# EAGLE schematic main_8to1plexer_dma_changed (EAGLE 7.6.0), part 1 of 2
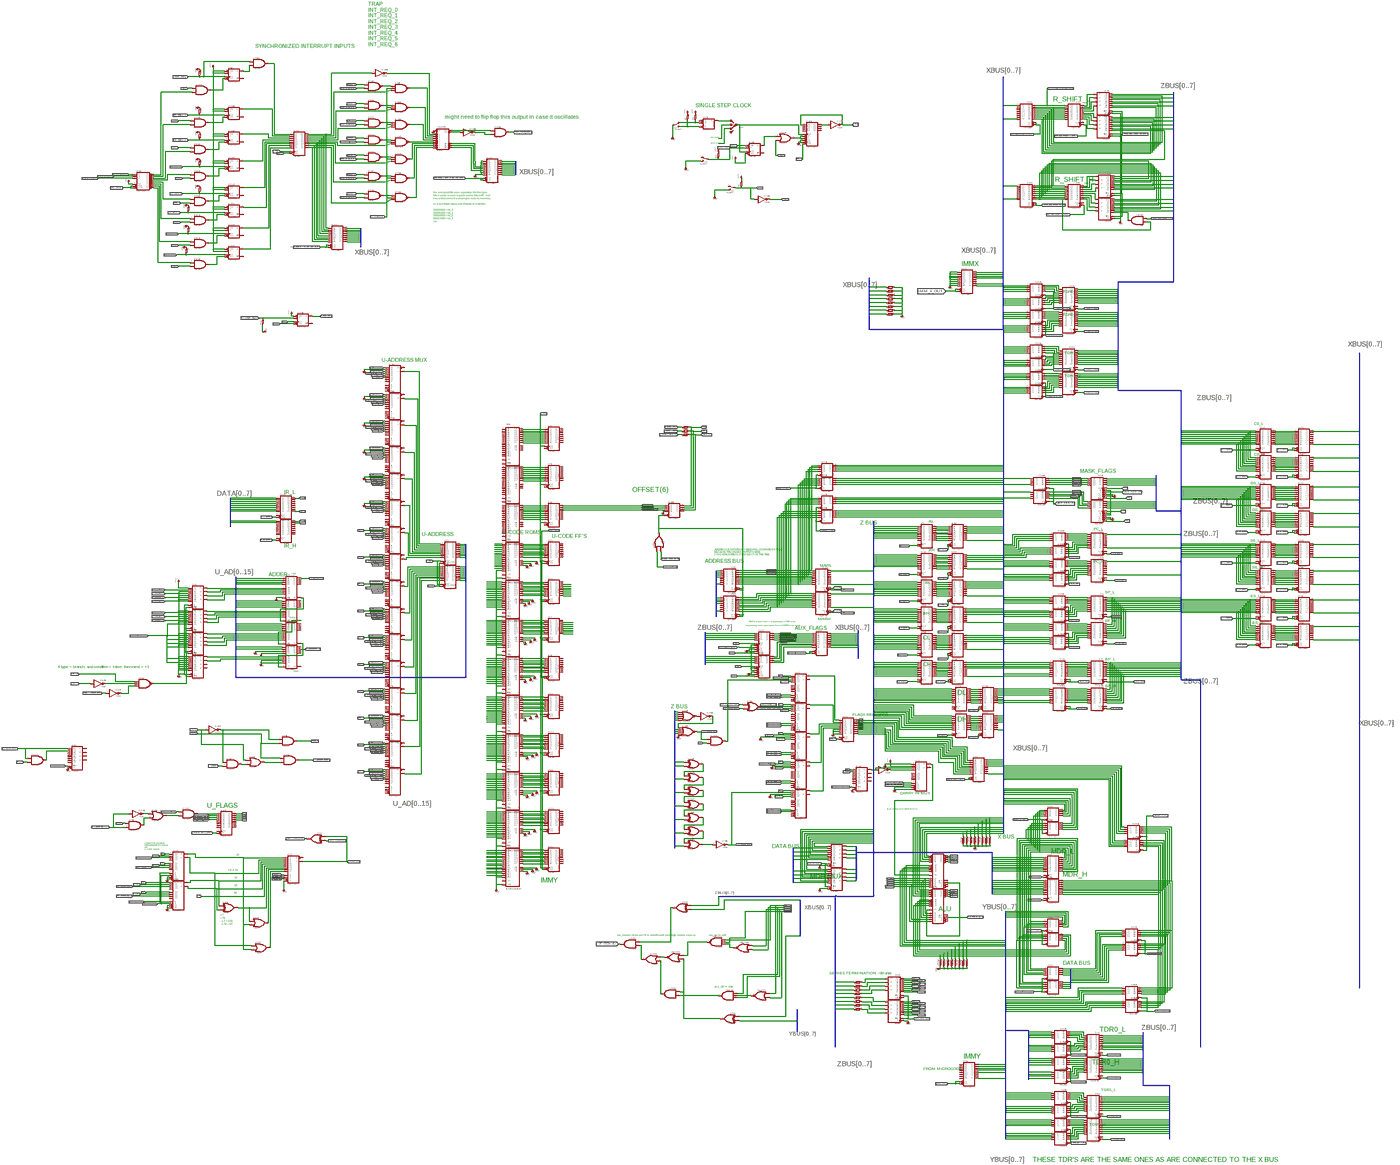
[diagram p0: schematic, sheet 1, overview]
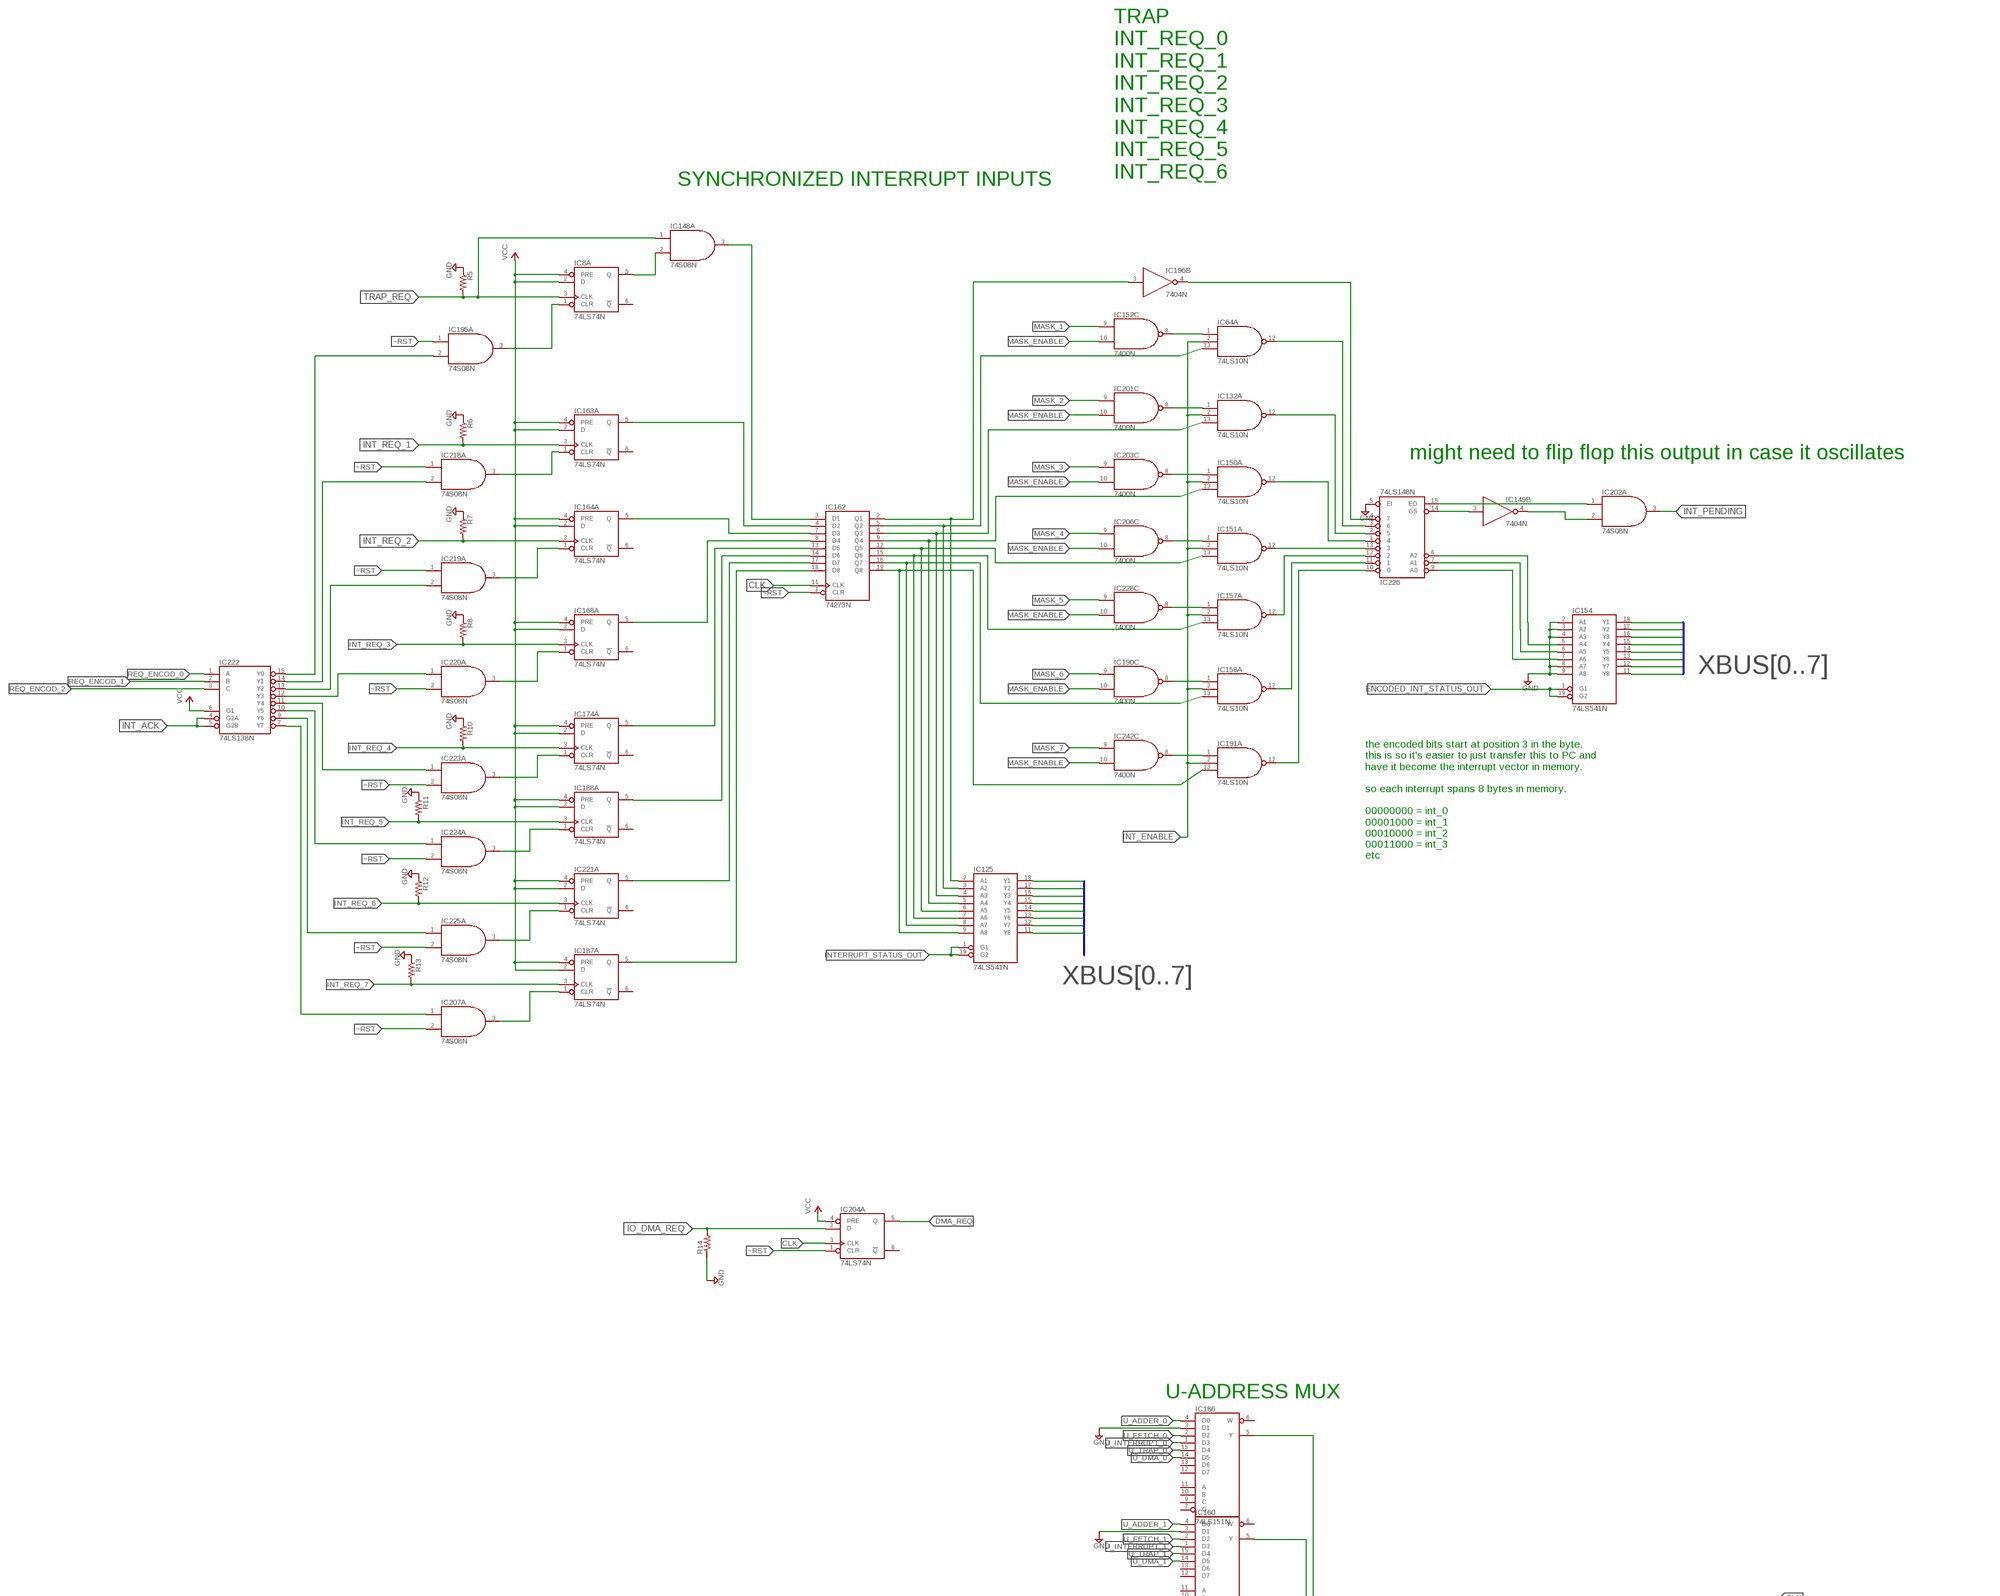
[diagram p1: schematic, sheet 1, part 1 of 9]
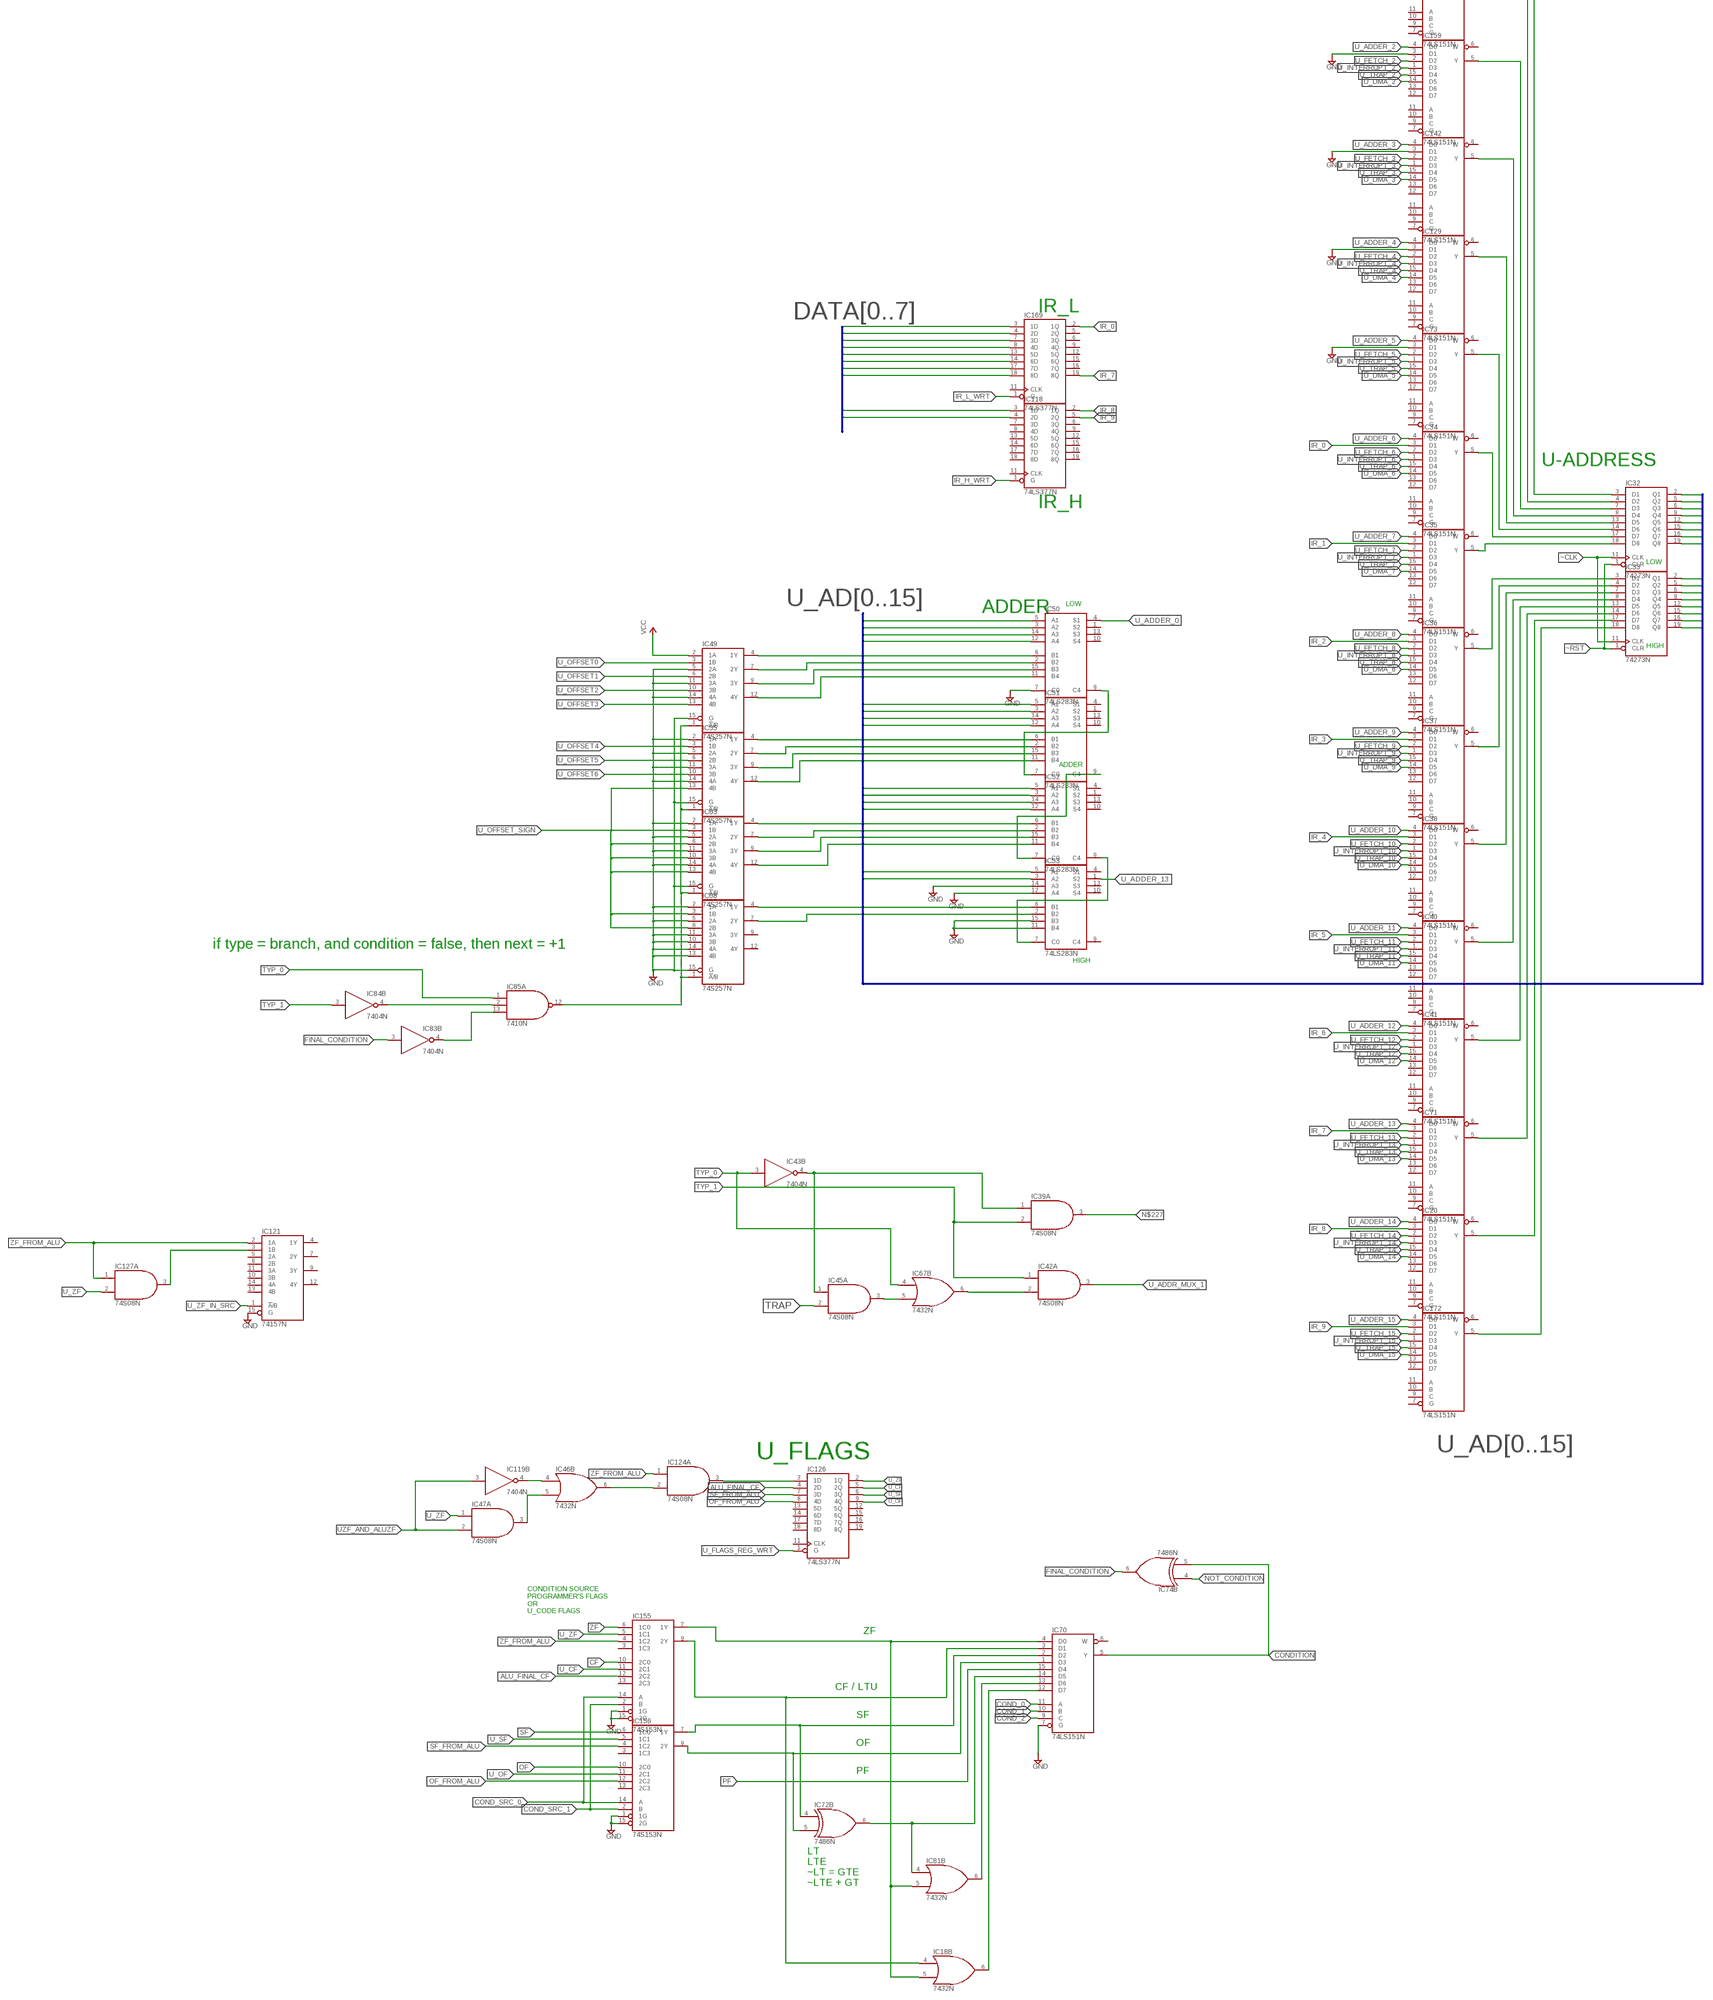
[diagram p2: schematic, sheet 1, part 2 of 9]
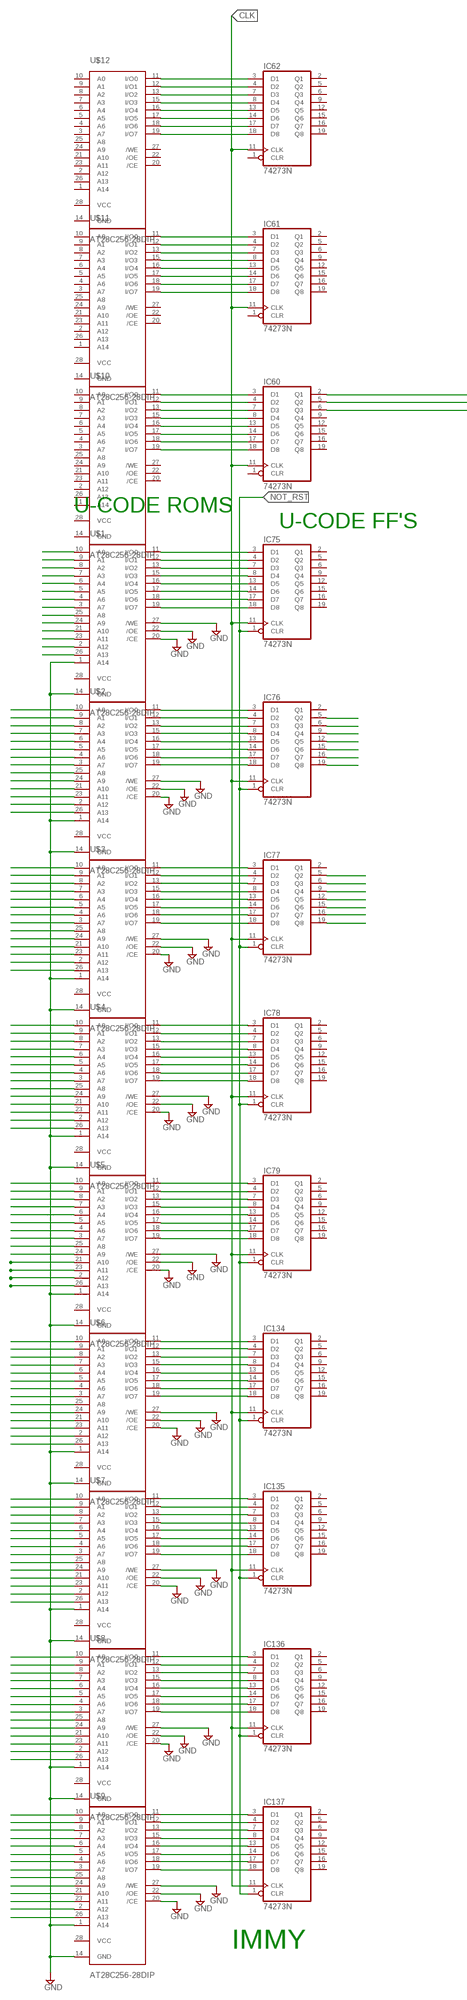
[diagram p3: schematic, sheet 1, part 3 of 9]
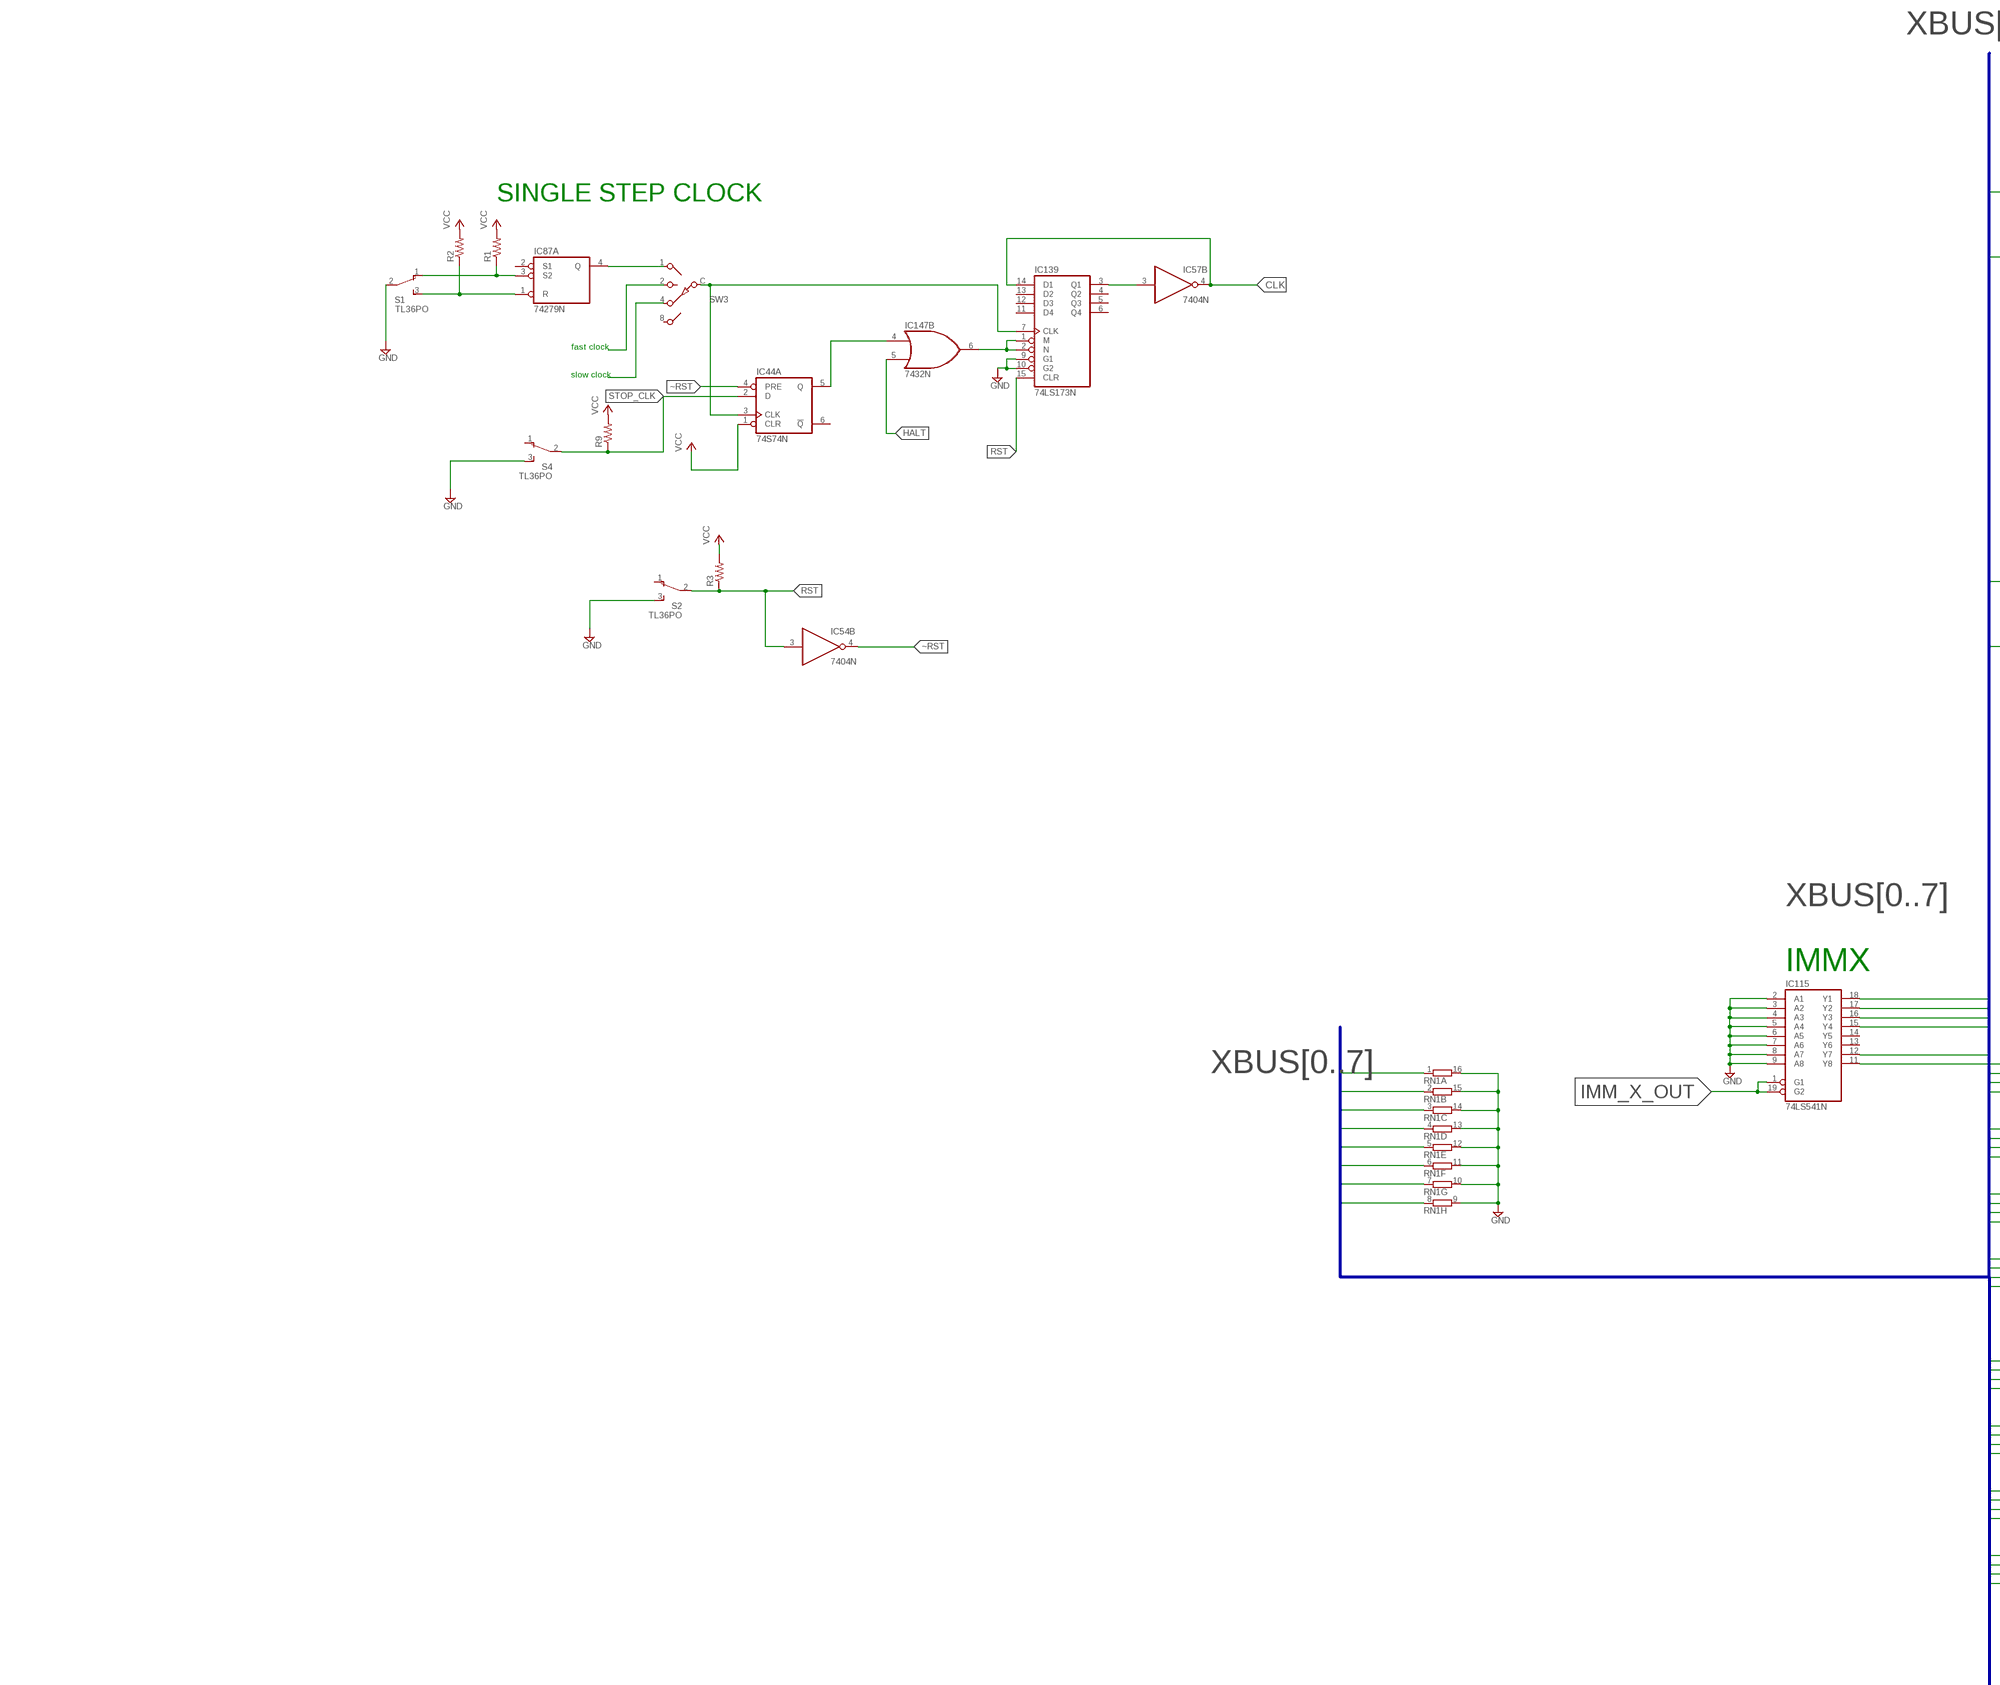
[diagram p4: schematic, sheet 1, part 4 of 9]
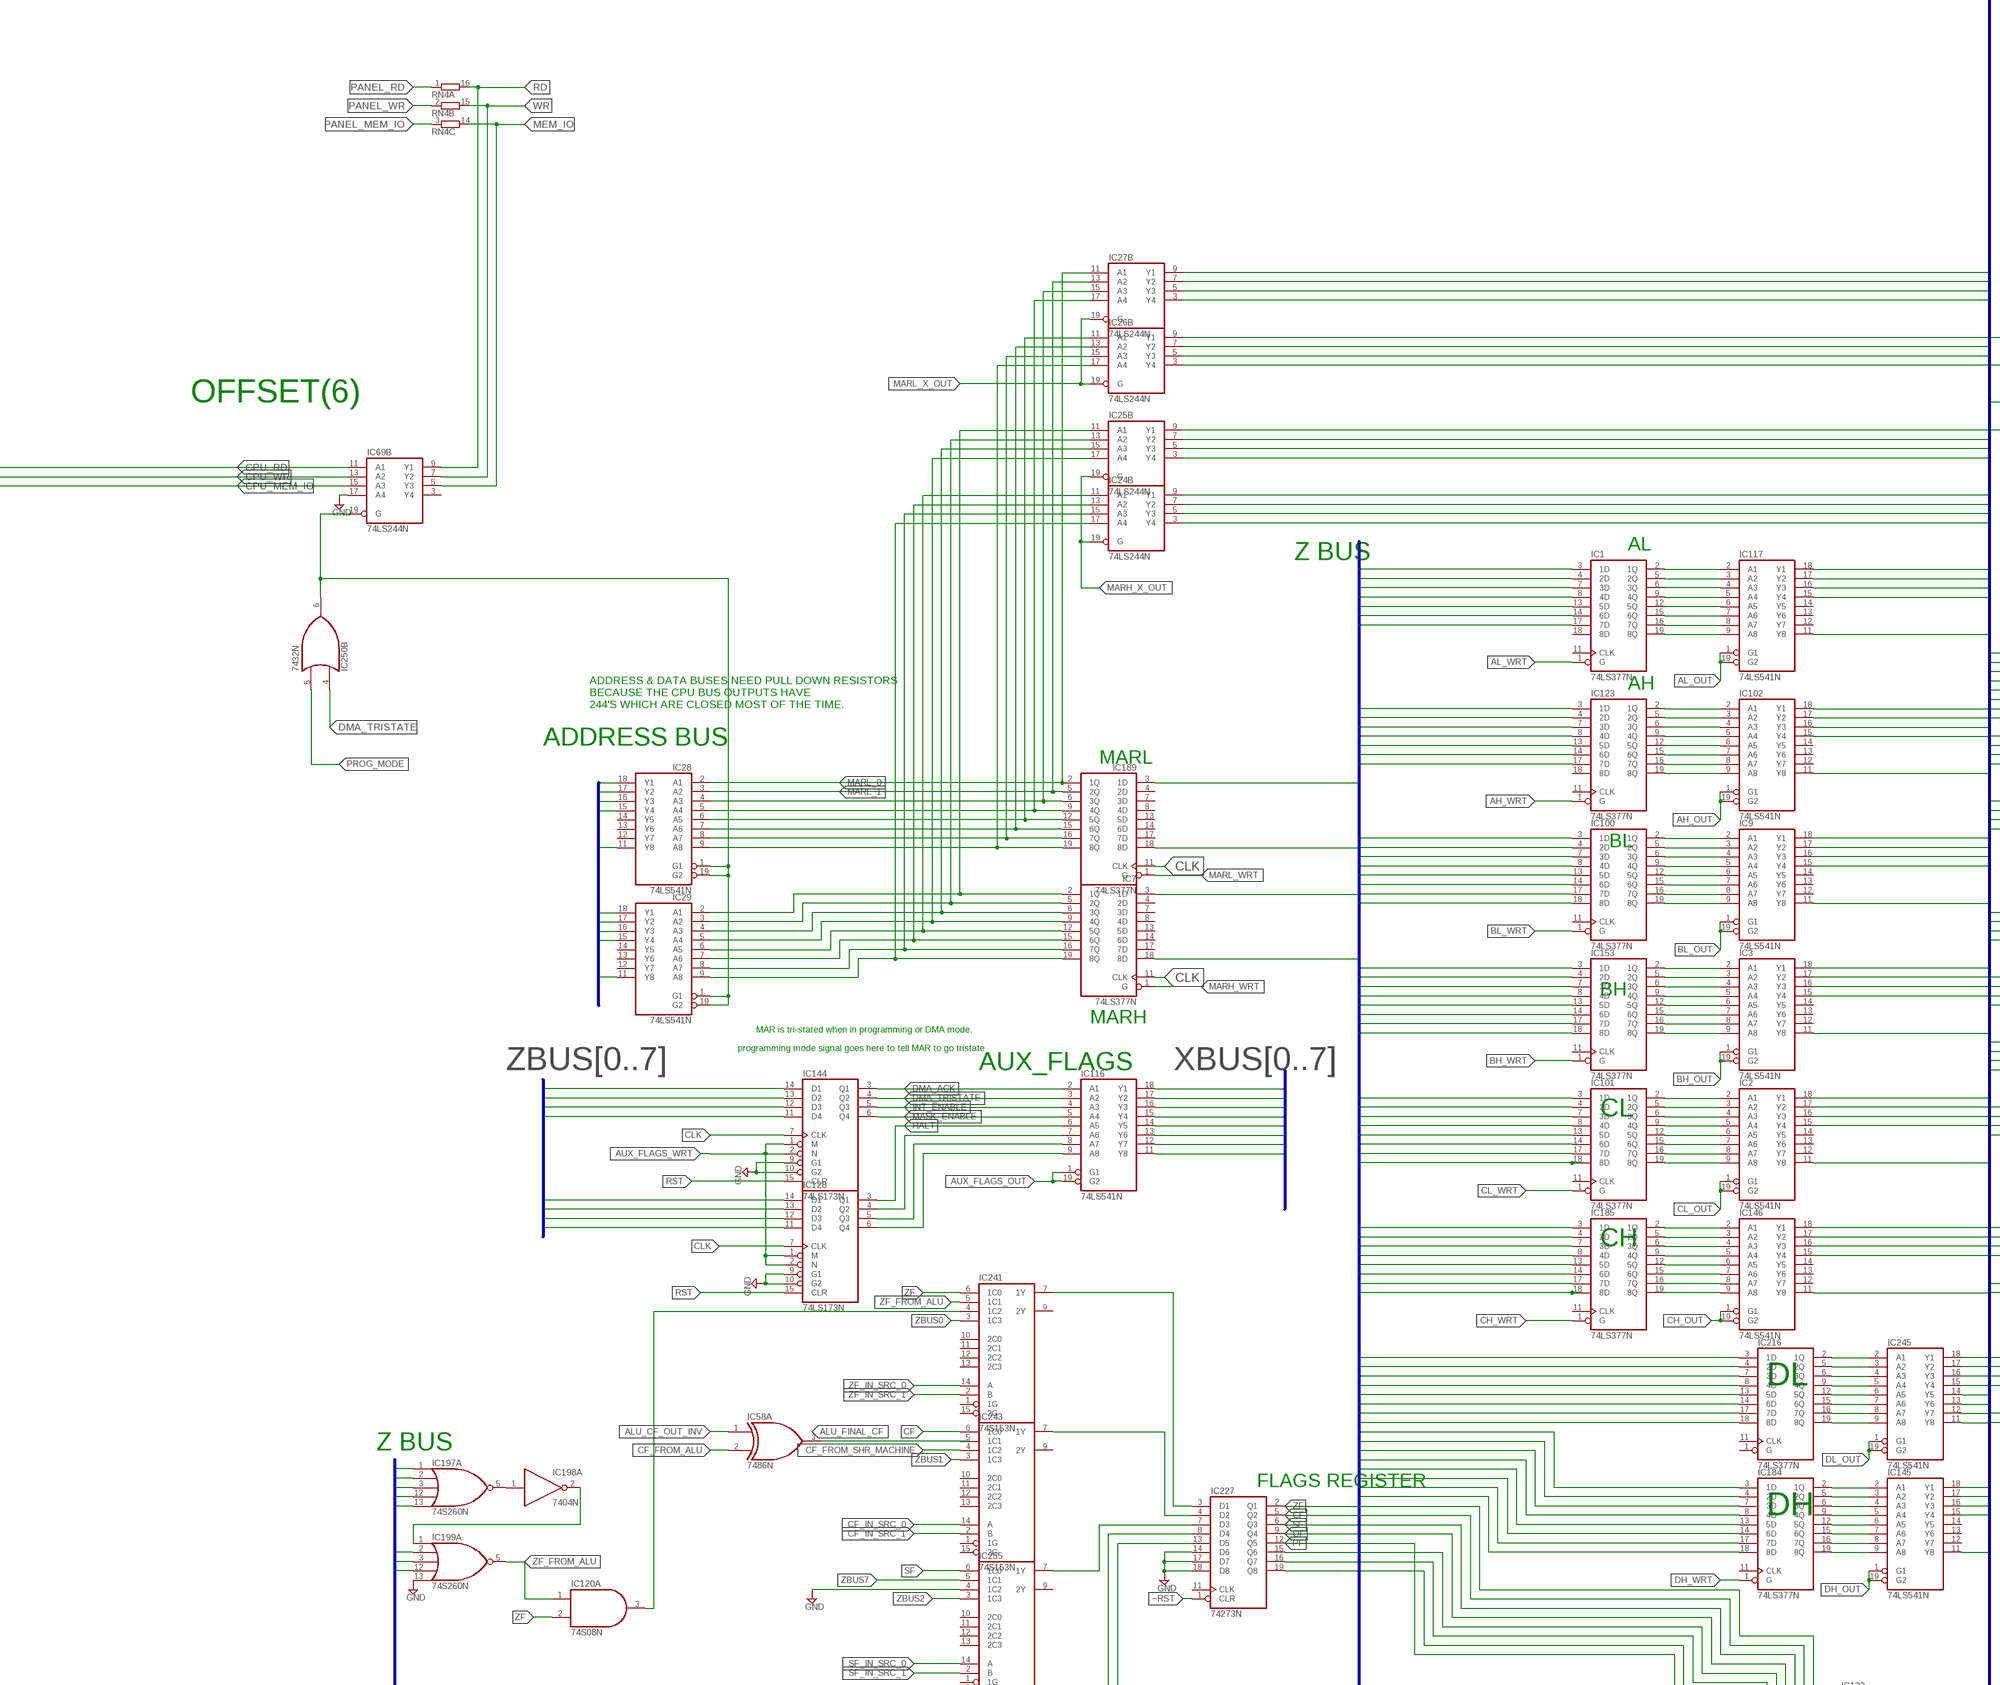
[diagram p5: schematic, sheet 1, part 5 of 9]
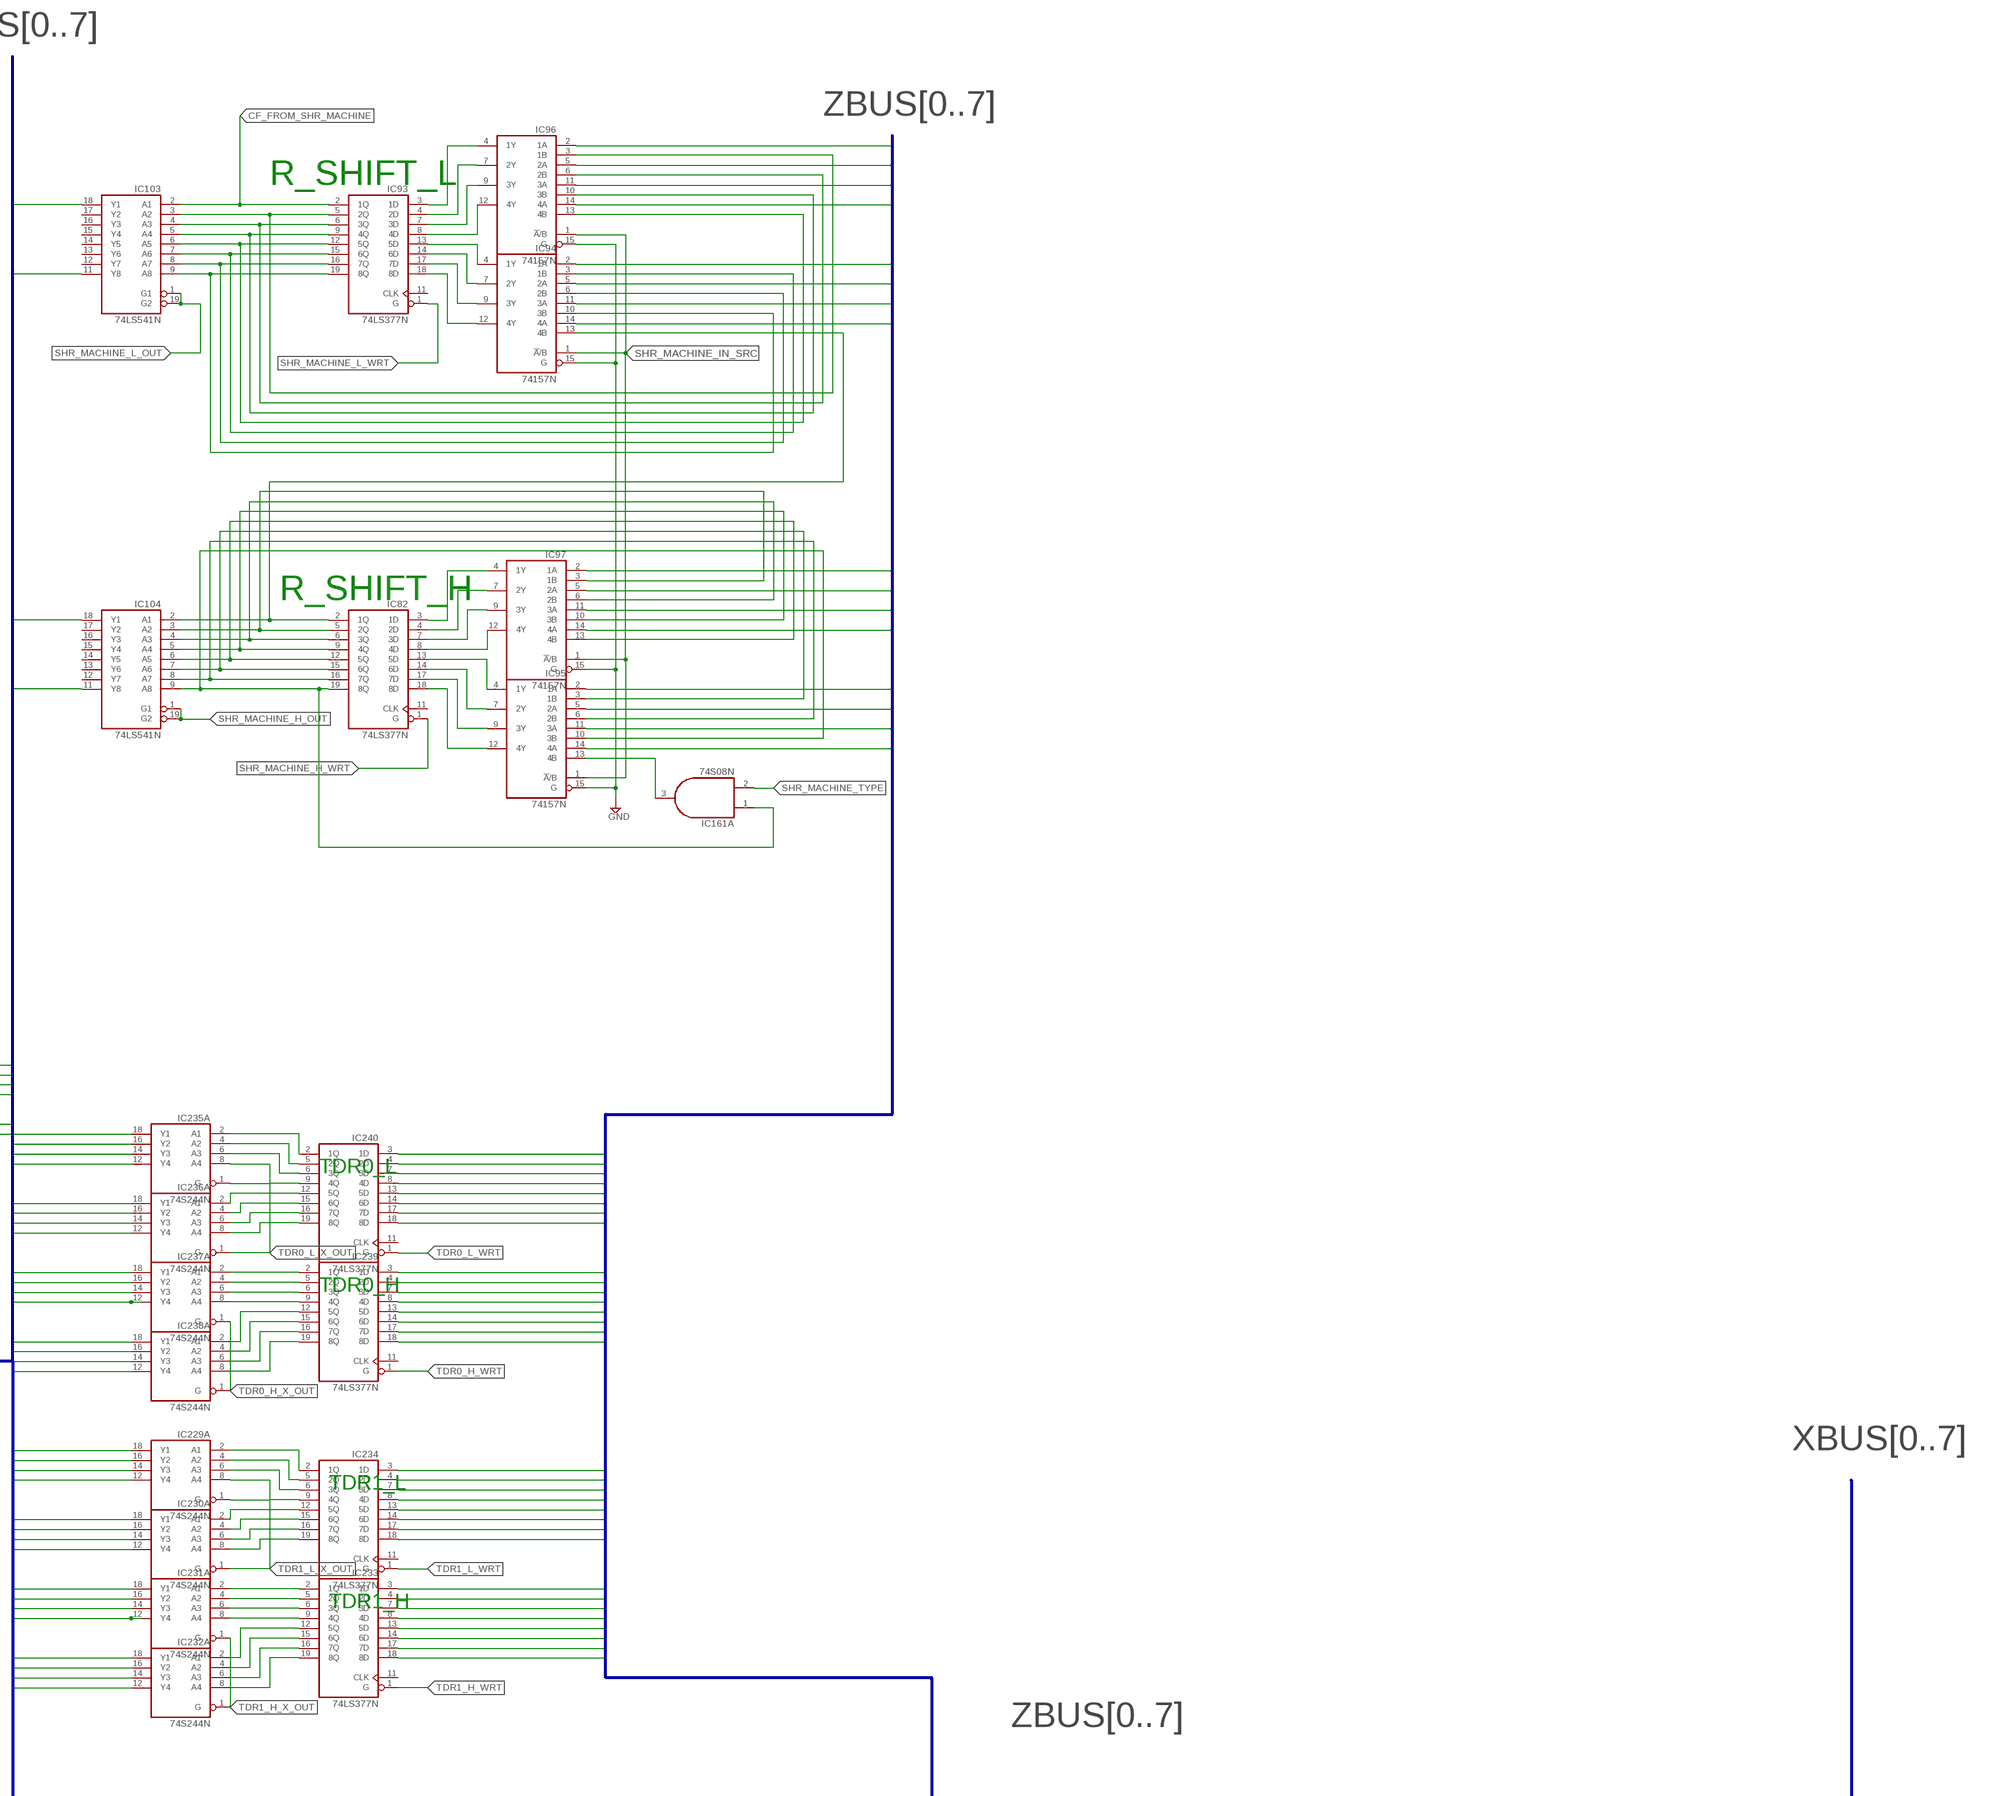
[diagram p6: schematic, sheet 1, part 6 of 9]
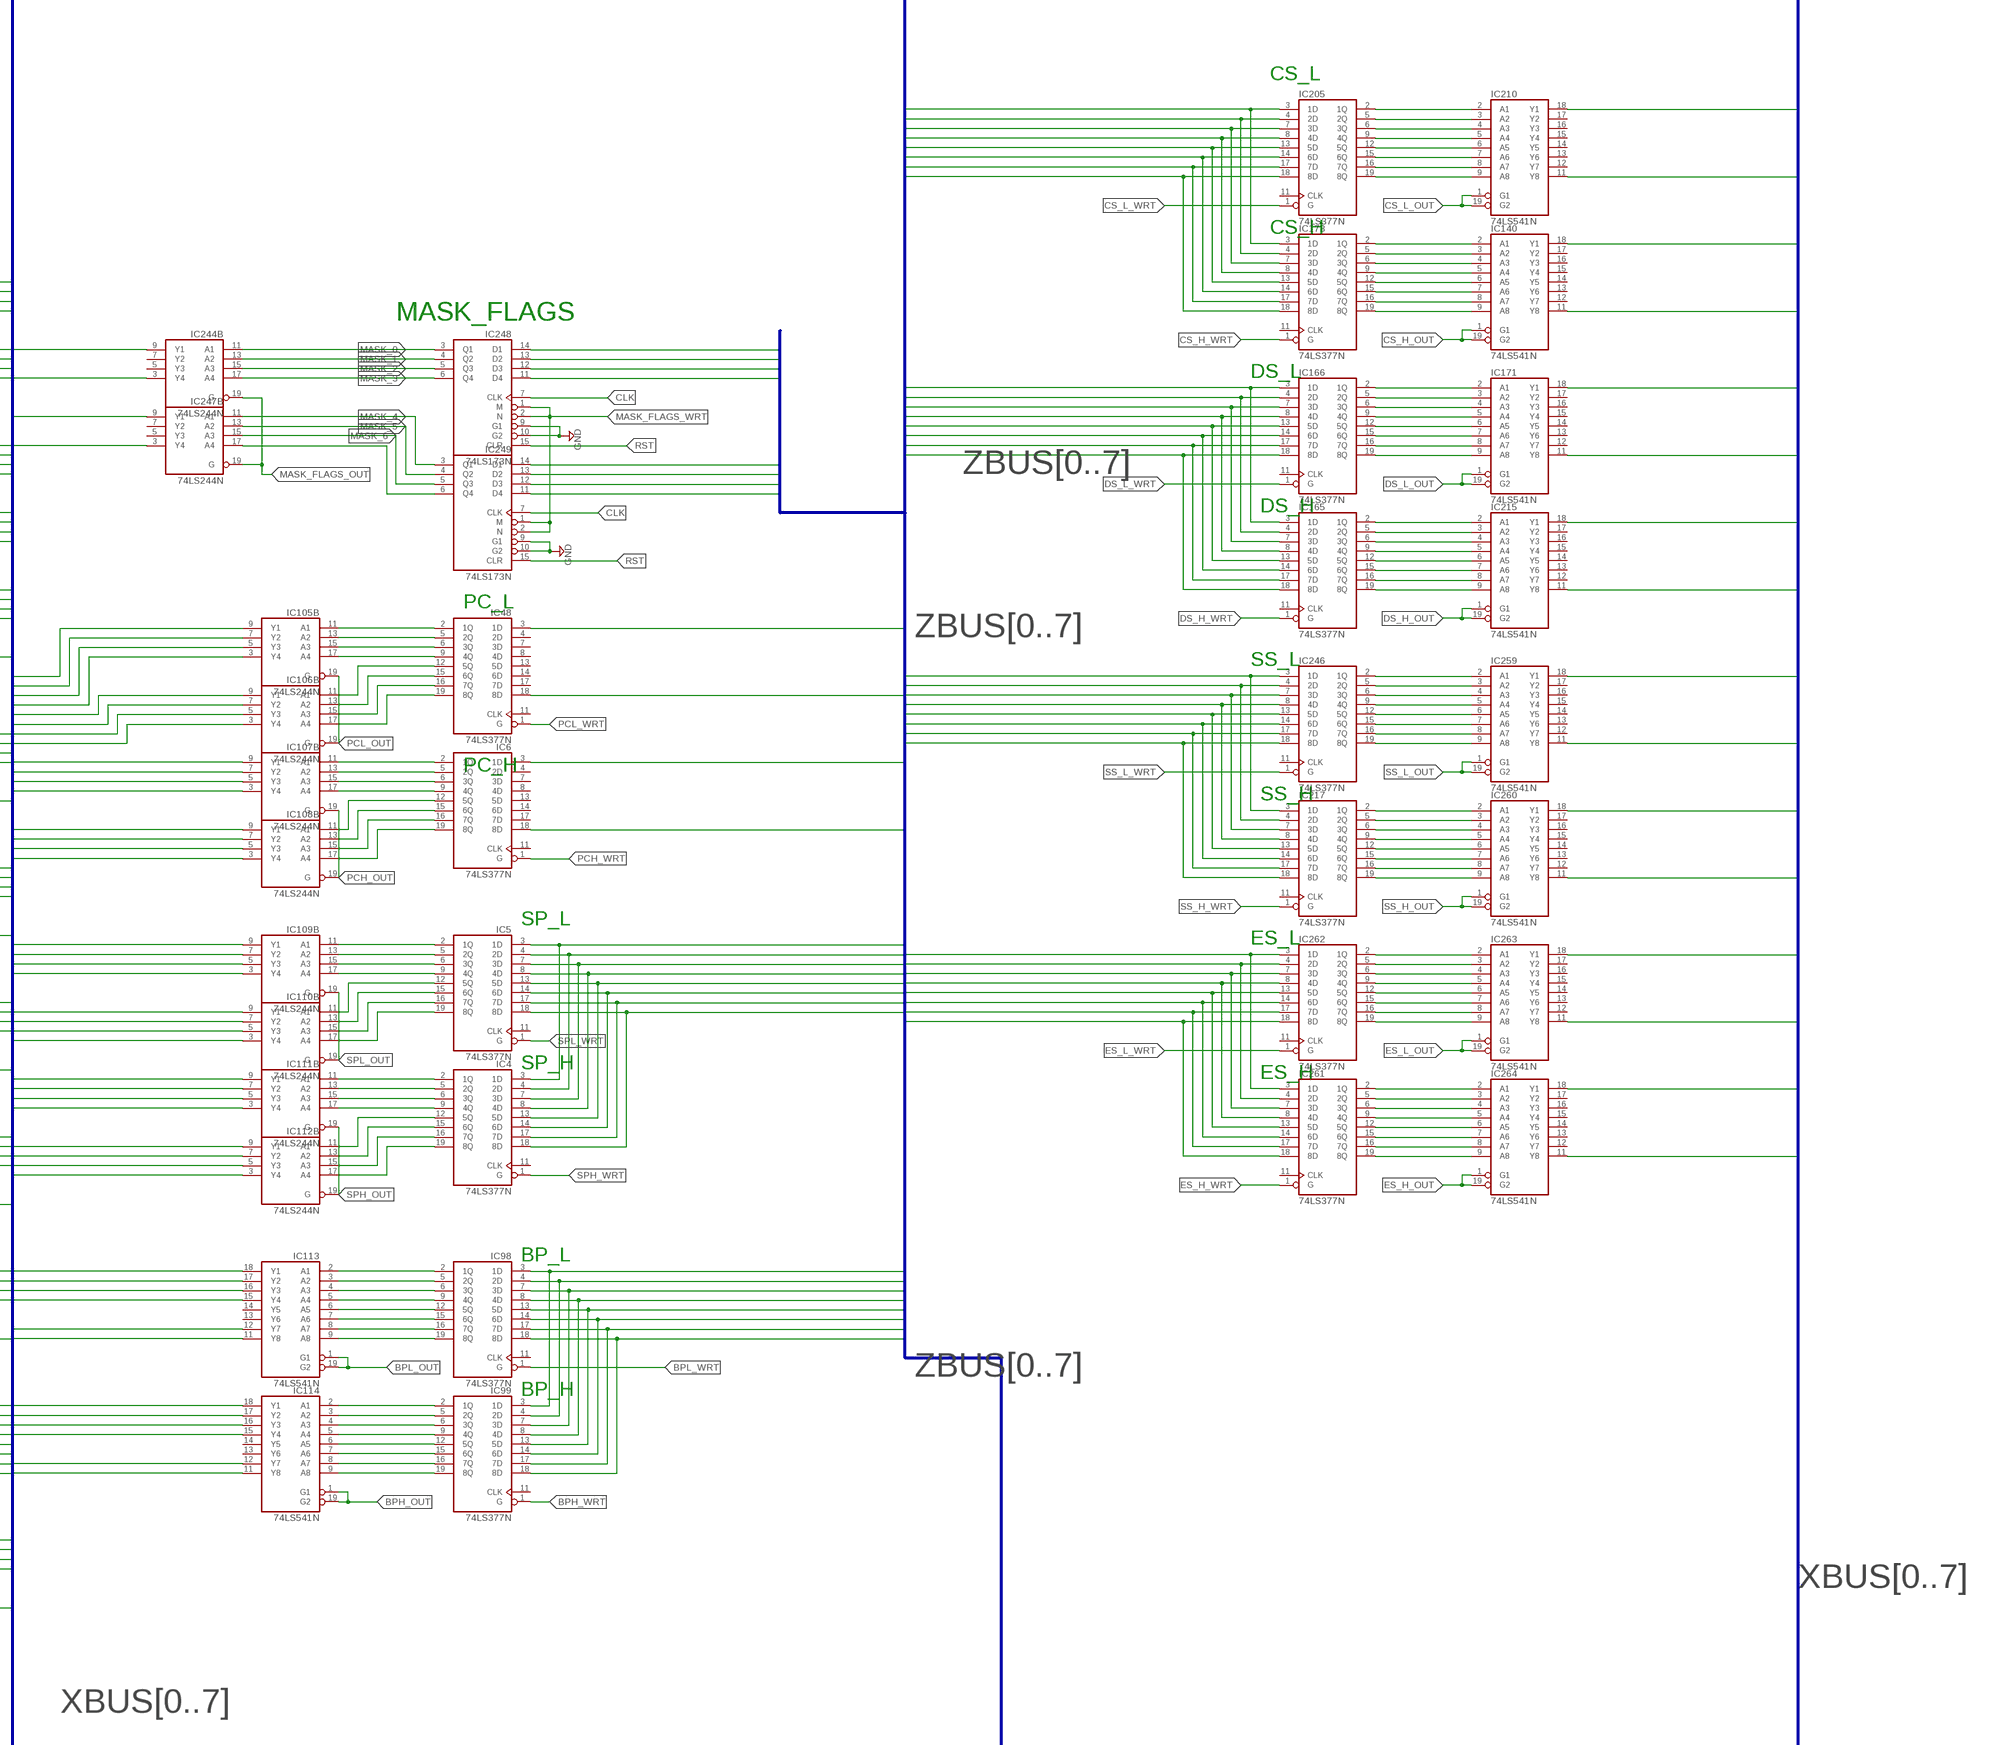
[diagram p7: schematic, sheet 1, part 7 of 9]
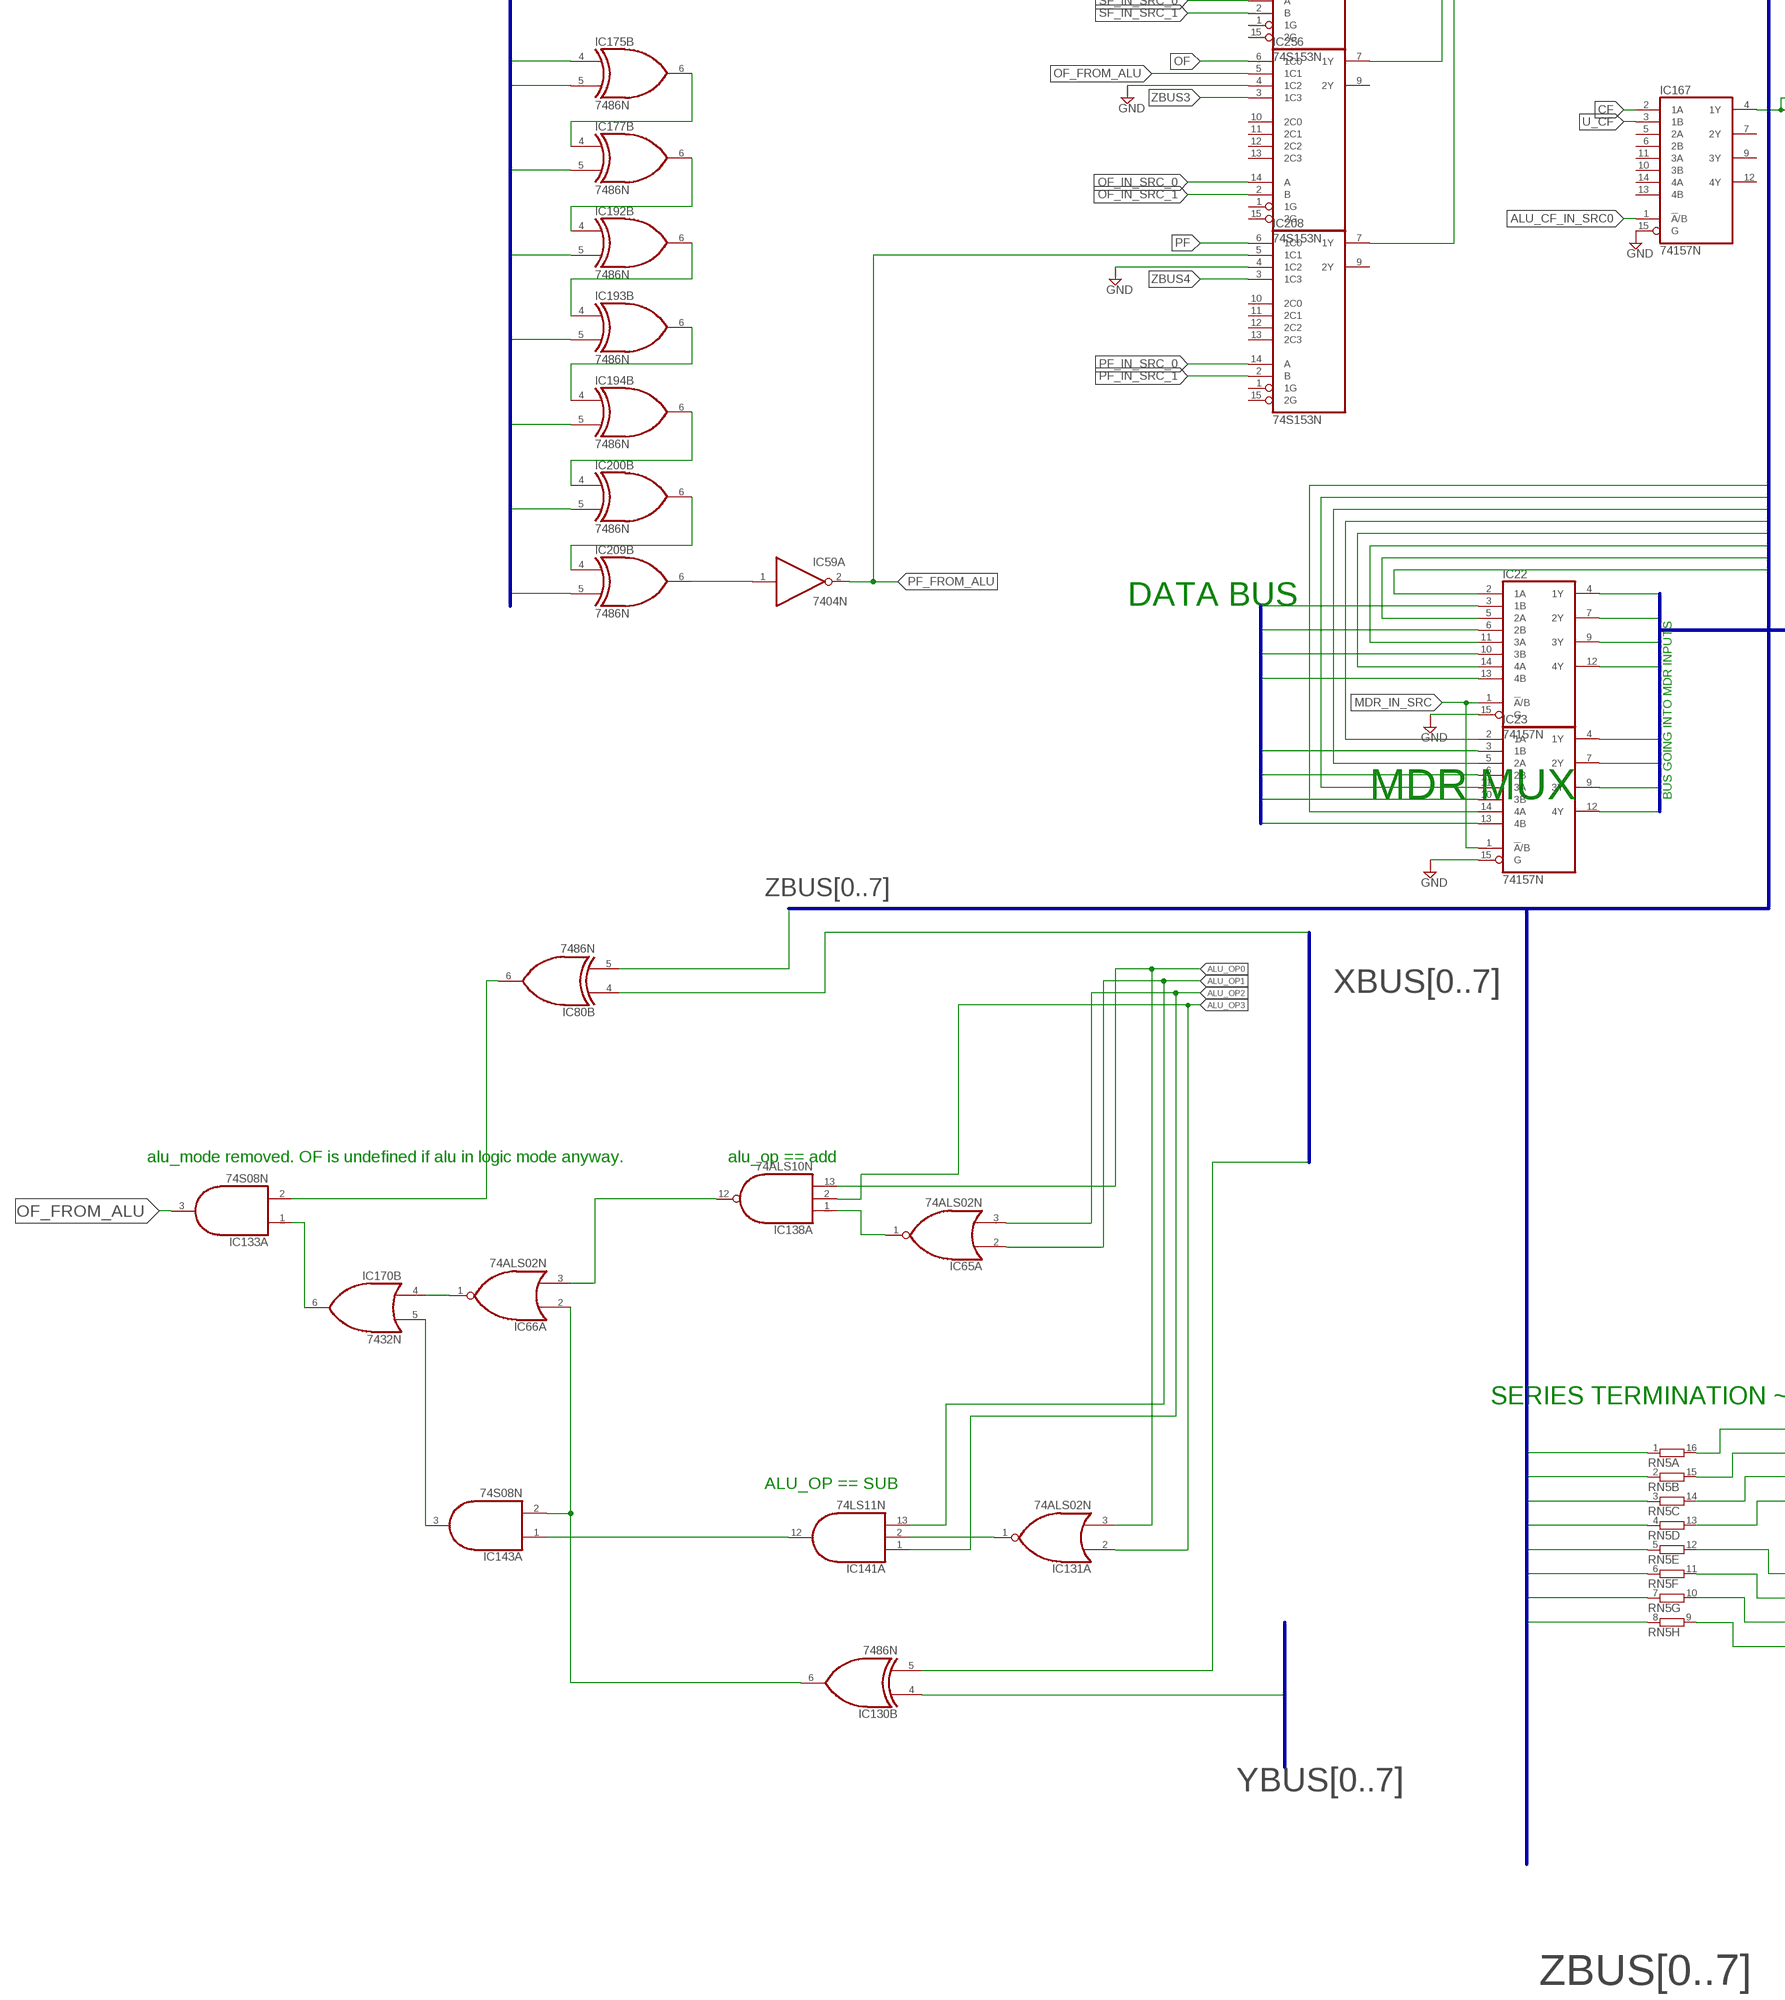
[diagram p8: schematic, sheet 1, part 8 of 9]
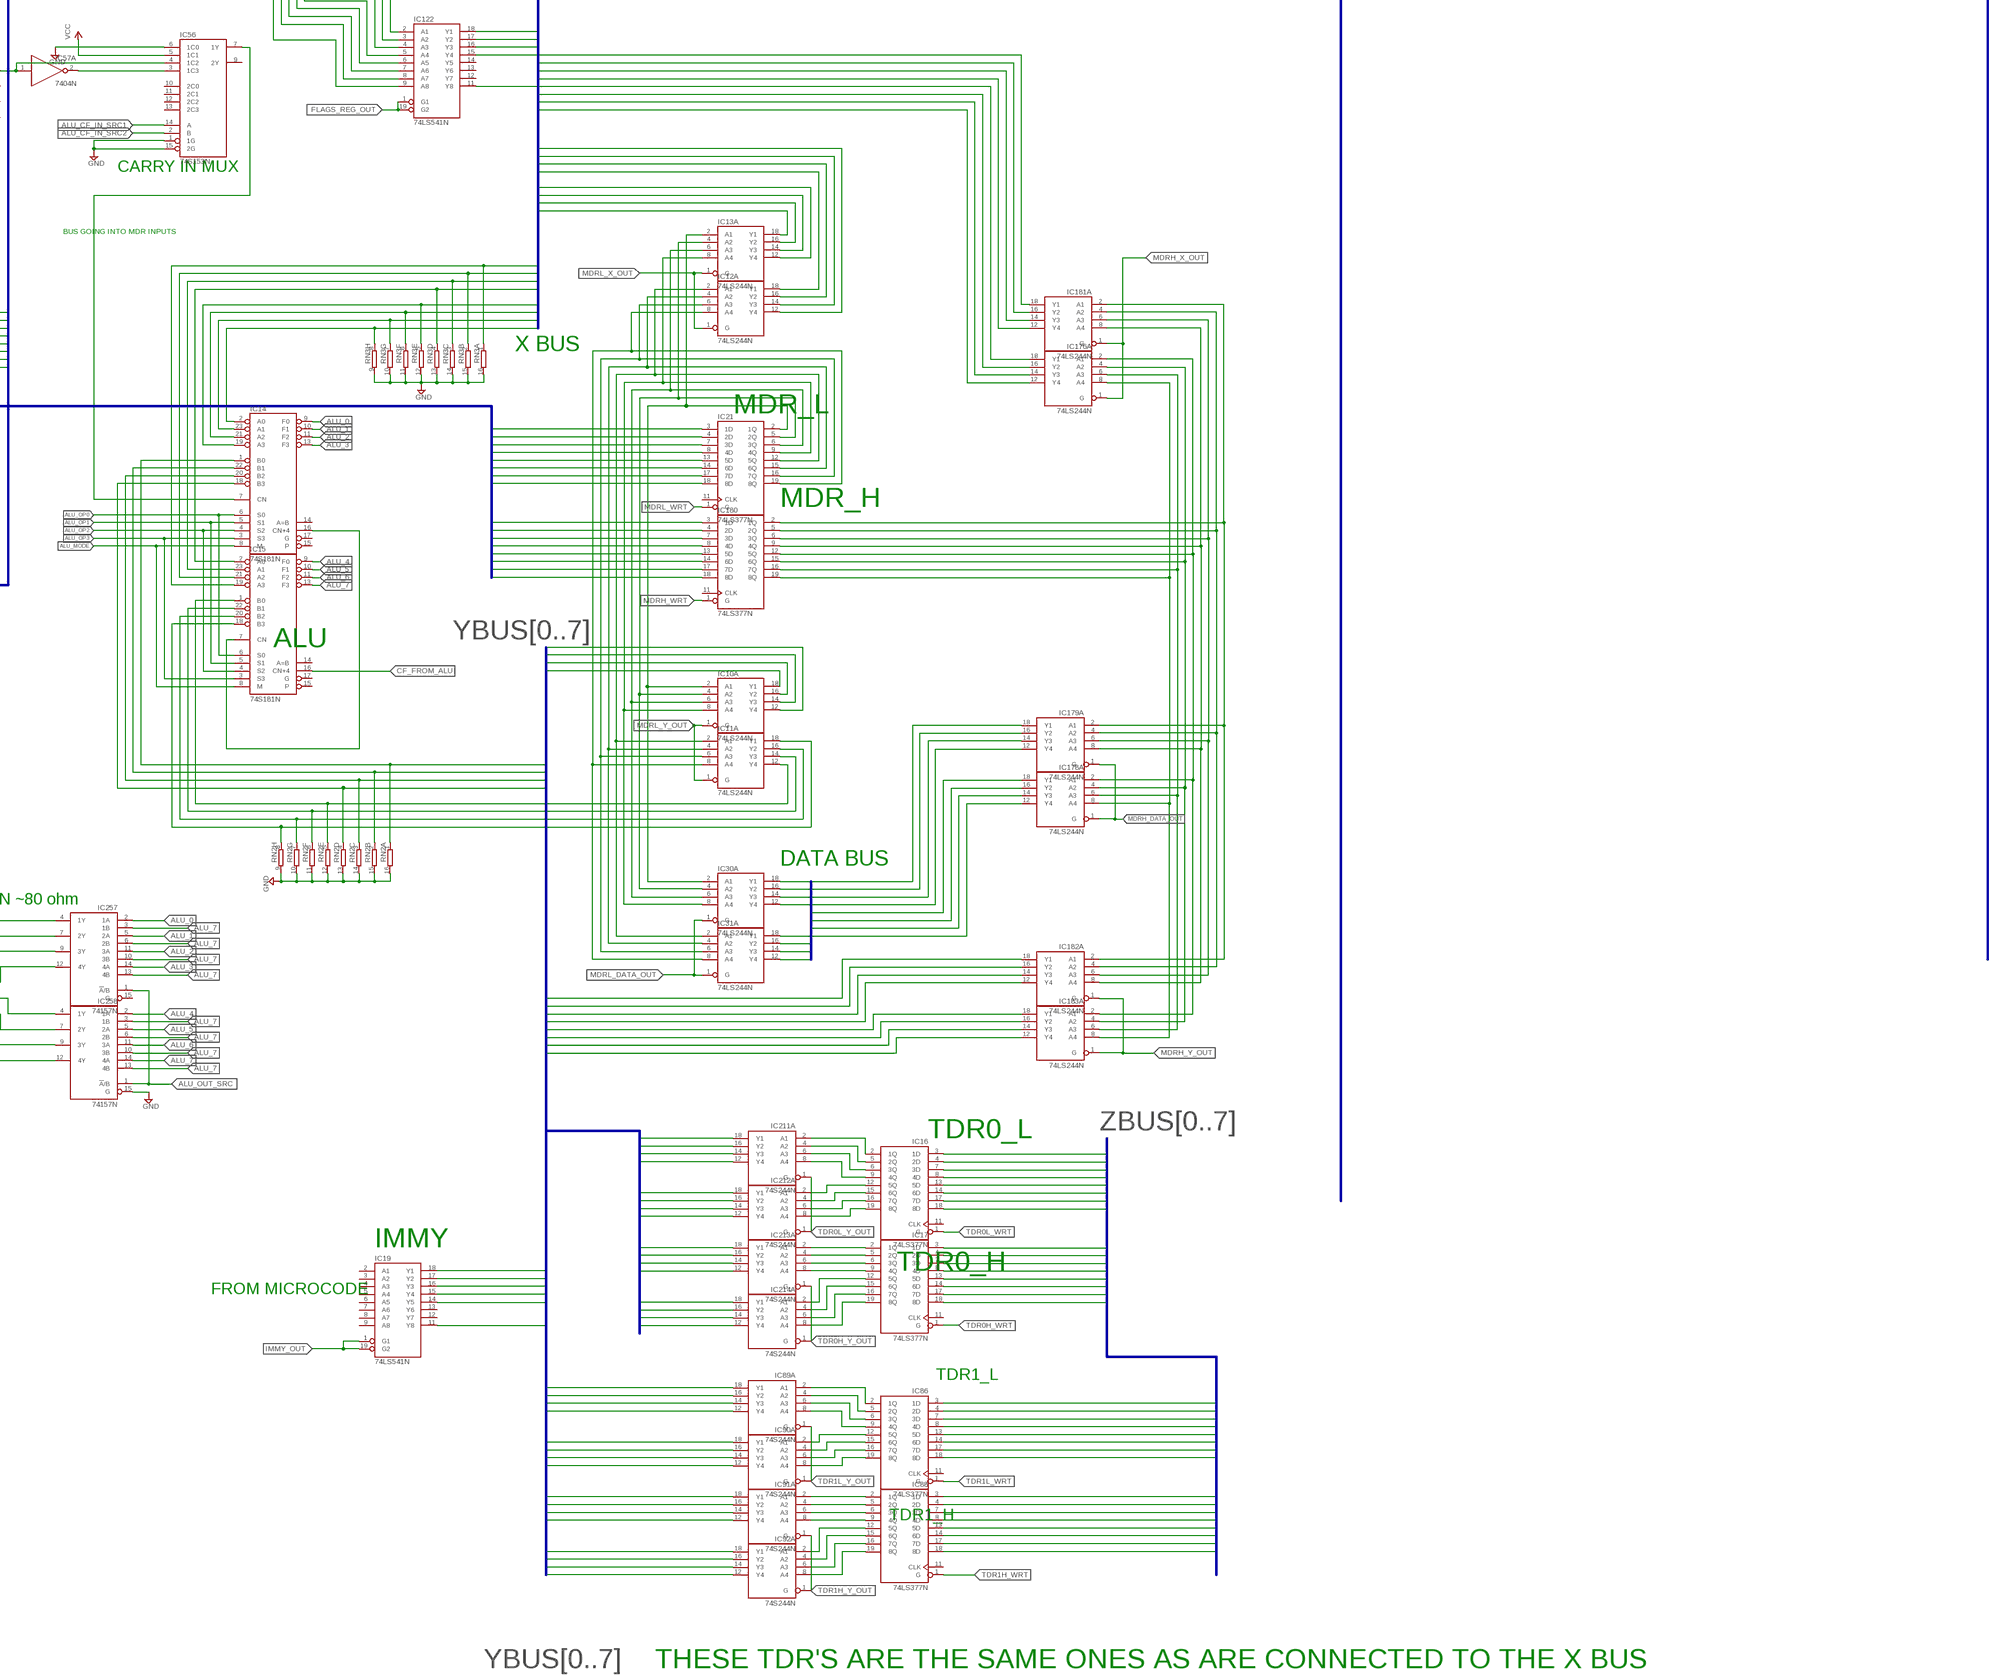
[diagram p9: schematic, sheet 1, part 9 of 9]

## Parts
IC1  74LS377N  [DIL20]
IC2  74LS541N  [DIL20]
IC3  74LS541N  [DIL20]
IC4  74LS377N  [DIL20]
IC5  74LS377N  [DIL20]
IC6  74LS377N  [DIL20]
IC7  74LS377N  [DIL20]
IC8  74LS74N  [DIL14]
IC9  74LS541N  [DIL20]
IC10  74LS244N  [DIL20]
IC11  74LS244N  [DIL20]
IC12  74LS244N  [DIL20]
IC13  74LS244N  [DIL20]
IC14  74S181N  [DIL24-6]
IC15  74S181N  [DIL24-6]
IC16  74LS377N  [DIL20]
IC17  74LS377N  [DIL20]
IC18  7432N  [DIL14]
IC19  74LS541N  [DIL20]
IC20  74LS151N  [DIL16]
IC21  74LS377N  [DIL20]
IC22  74157N  [DIL16]
IC23  74157N  [DIL16]
IC24  74LS244N  [DIL20]
IC25  74LS244N  [DIL20]
IC26  74LS244N  [DIL20]
IC27  74LS244N  [DIL20]
IC28  74LS541N  [DIL20]
IC29  74LS541N  [DIL20]
IC30  74LS244N  [DIL20]
IC31  74LS244N  [DIL20]
IC32  74273N  [DIL20]
IC33  74273N  [DIL20]
IC34  74LS151N  [DIL16]
IC35  74LS151N  [DIL16]
IC36  74LS151N  [DIL16]
IC37  74LS151N  [DIL16]
IC38  74LS151N  [DIL16]
IC39  74S08N  [DIL14]
IC40  74LS151N  [DIL16]
IC41  74LS151N  [DIL16]
IC42  74S08N  [DIL14]
IC43  7404N  [DIL14]
IC44  74S74N  [DIL14]
IC45  74S08N  [DIL14]
IC46  7432N  [DIL14]
IC47  74S08N  [DIL14]
IC48  74LS377N  [DIL20]
IC49  74S257N  [DIL16]
IC50  74LS283N  [DIL16]
IC51  74LS283N  [DIL16]
IC52  74LS283N  [DIL16]
IC53  74LS283N  [DIL16]
IC54  7404N  [DIL14]
IC55  74S257N  [DIL16]
IC56  74S153N  [DIL16]
IC57  7404N  [DIL14]
IC58  7486N  [DIL14]
IC59  7404N  [DIL14]
IC60  74273N  [DIL20]
IC61  74273N  [DIL20]
IC62  74273N  [DIL20]
IC63  74S257N  [DIL16]
IC64  74LS10N  [DIL14]
IC65  74ALS02N  [DIL14]
IC66  74ALS02N  [DIL14]
IC67  7432N  [DIL14]
IC68  74S257N  [DIL16]
IC69  74LS244N  [DIL20]
IC70  74LS151N  [DIL16]
IC71  74LS151N  [DIL16]
IC72  7486N  [DIL14]
IC73  74LS151N  [DIL16]
IC74  7486N  [DIL14]
IC75  74273N  [DIL20]
IC76  74273N  [DIL20]
IC77  74273N  [DIL20]
IC78  74273N  [DIL20]
IC79  74273N  [DIL20]
IC80  7486N  [DIL14]
IC81  7432N  [DIL14]
IC82  74LS377N  [DIL20]
IC83  7404N  [DIL14]
IC84  7404N  [DIL14]
IC85  7410N  [DIL14]
IC86  74LS377N  [DIL20]
IC87  74279N  [DIL16]
IC88  74LS377N  [DIL20]
IC89  74S244N  [DIL20]
IC90  74S244N  [DIL20]
IC91  74S244N  [DIL20]
IC92  74S244N  [DIL20]
IC93  74LS377N  [DIL20]
IC94  74157N  [DIL16]
IC95  74157N  [DIL16]
IC96  74157N  [DIL16]
IC97  74157N  [DIL16]
IC98  74LS377N  [DIL20]
IC99  74LS377N  [DIL20]
IC100  74LS377N  [DIL20]
IC101  74LS377N  [DIL20]
IC102  74LS541N  [DIL20]
IC103  74LS541N  [DIL20]
IC104  74LS541N  [DIL20]
IC105  74LS244N  [DIL20]
IC106  74LS244N  [DIL20]
IC107  74LS244N  [DIL20]
IC108  74LS244N  [DIL20]
IC109  74LS244N  [DIL20]
IC110  74LS244N  [DIL20]
IC111  74LS244N  [DIL20]
IC112  74LS244N  [DIL20]
IC113  74LS541N  [DIL20]
IC114  74LS541N  [DIL20]
IC115  74LS541N  [DIL20]
IC116  74LS541N  [DIL20]
IC117  74LS541N  [DIL20]
IC118  74LS377N  [DIL20]
IC119  7404N  [DIL14]
IC120  74S08N  [DIL14]
IC121  74157N  [DIL16]
IC122  74LS541N  [DIL20]
IC123  74LS377N  [DIL20]
IC124  74S08N  [DIL14]
IC125  74LS541N  [DIL20]
IC126  74LS377N  [DIL20]
IC127  74S08N  [DIL14]
IC128  74LS173N  [DIL16]
IC129  74LS151N  [DIL16]
IC130  7486N  [DIL14]
IC131  74ALS02N  [DIL14]
IC132  74LS10N  [DIL14]
IC133  74S08N  [DIL14]
IC134  74273N  [DIL20]
IC135  74273N  [DIL20]
IC136  74273N  [DIL20]
IC137  74273N  [DIL20]
IC138  74ALS10N  [DIL14]
IC139  74LS173N  [DIL16]
IC140  74LS541N  [DIL20]
IC141  74LS11N  [DIL14]
IC142  74LS151N  [DIL16]
IC143  74S08N  [DIL14]
IC144  74LS173N  [DIL16]
IC145  74LS541N  [DIL20]
IC146  74LS541N  [DIL20]
IC147  7432N  [DIL14]
IC148  74S08N  [DIL14]
IC149  7404N  [DIL14]
IC150  74LS10N  [DIL14]
IC151  74LS10N  [DIL14]
IC152  7400N  [DIL14]
IC153  74LS377N  [DIL20]
IC154  74LS541N  [DIL20]
IC155  74S153N  [DIL16]
IC156  74S153N  [DIL16]
IC157  74LS10N  [DIL14]
IC158  74LS10N  [DIL14]
IC159  74LS151N  [DIL16]
IC160  74LS151N  [DIL16]
IC161  74S08N  [DIL14]
IC162  74273N  [DIL20]
IC163  74LS74N  [DIL14]
IC164  74LS74N  [DIL14]
IC165  74LS377N  [DIL20]
IC166  74LS377N  [DIL20]
IC167  74157N  [DIL16]
IC168  74LS74N  [DIL14]
IC169  74LS377N  [DIL20]
IC170  7432N  [DIL14]
IC171  74LS541N  [DIL20]
IC172  74LS151N  [DIL16]
IC173  74LS377N  [DIL20]
IC174  74LS74N  [DIL14]
IC175  7486N  [DIL14]
IC176  74LS244N  [DIL20]
IC177  7486N  [DIL14]
IC178  74LS244N  [DIL20]
IC179  74LS244N  [DIL20]
IC180  74LS377N  [DIL20]
IC181  74LS244N  [DIL20]
IC182  74LS244N  [DIL20]
IC183  74LS244N  [DIL20]
IC184  74LS377N  [DIL20]
IC185  74LS377N  [DIL20]
IC186  74LS151N  [DIL16]
IC187  74LS74N  [DIL14]
IC188  74LS74N  [DIL14]
IC189  74LS377N  [DIL20]
IC190  7400N  [DIL14]
IC191  74LS10N  [DIL14]
IC192  7486N  [DIL14]
IC193  7486N  [DIL14]
IC194  7486N  [DIL14]
IC195  74S08N  [DIL14]
IC196  7404N  [DIL14]
IC197  74S260N  [DIL14]
IC198  7404N  [DIL14]
IC199  74S260N  [DIL14]
IC200  7486N  [DIL14]
IC201  7400N  [DIL14]
IC202  74S08N  [DIL14]
IC203  7400N  [DIL14]
IC204  74LS74N  [DIL14]
IC205  74LS377N  [DIL20]
IC206  7400N  [DIL14]
IC207  74S08N  [DIL14]
IC208  74S153N  [DIL16]
IC209  7486N  [DIL14]
IC210  74LS541N  [DIL20]
IC211  74S244N  [DIL20]
IC212  74S244N  [DIL20]
IC213  74S244N  [DIL20]
IC214  74S244N  [DIL20]
IC215  74LS541N  [DIL20]
IC216  74LS377N  [DIL20]
IC217  74LS377N  [DIL20]
IC218  74S08N  [DIL14]
IC219  74S08N  [DIL14]
IC220  74S08N  [DIL14]
IC221  74LS74N  [DIL14]
IC222  74LS138N  [DIL16]
IC223  74S08N  [DIL14]
IC224  74S08N  [DIL14]
IC225  74S08N  [DIL14]
IC226  74LS148N  [DIL16]
IC227  74273N  [DIL20]
IC228  7400N  [DIL14]
IC229  74S244N  [DIL20]
IC230  74S244N  [DIL20]
IC231  74S244N  [DIL20]
IC232  74S244N  [DIL20]
IC233  74LS377N  [DIL20]
IC234  74LS377N  [DIL20]
IC235  74S244N  [DIL20]
IC236  74S244N  [DIL20]
IC237  74S244N  [DIL20]
IC238  74S244N  [DIL20]
IC239  74LS377N  [DIL20]
IC240  74LS377N  [DIL20]
IC241  74S153N  [DIL16]
IC242  7400N  [DIL14]
IC243  74S153N  [DIL16]
IC244  74LS244N  [DIL20]
IC245  74LS541N  [DIL20]
IC246  74LS377N  [DIL20]
IC247  74LS244N  [DIL20]
IC248  74LS173N  [DIL16]
IC249  74LS173N  [DIL16]
IC250  7432N  [DIL14]
IC255  74S153N  [DIL16]
IC256  74S153N  [DIL16]
IC257  74157N  [DIL16]
IC258  74157N  [DIL16]
IC259  74LS541N  [DIL20]
IC260  74LS541N  [DIL20]
IC261  74LS377N  [DIL20]
IC262  74LS377N  [DIL20]
IC263  74LS541N  [DIL20]
IC264  74LS541N  [DIL20]
R1  R-US_0204/2V  [0204V]
R2  R-US_0204/2V  [0204V]
R3  R-US_0204/2V  [0204V]
R5  R-US_0204/7  [0204/7]
R6  R-US_0204/7  [0204/7]
R7  R-US_0204/7  [0204/7]
R8  R-US_0204/7  [0204/7]
R9  R-US_0204/2V  [0204V]
R10  R-US_0204/7  [0204/7]
R11  R-US_0204/7  [0204/7]
R12  R-US_0204/7  [0204/7]
R13  R-US_0204/7  [0204/7]
R14  R-US_0204/7  [0204/7]
RN1  8R-N  [DIL16]
RN2  8R-N  [DIL16]
RN3  8R-N  [DIL16]
RN4  8R-N  [DIL16]
RN5  8R-N  [DIL16]
S1  TL36PO  [TL3XPO]
S2  TL36PO  [TL3XPO]
S4  TL36PO  [TL3XPO]
SW3  SW-C10  [SW-C10]
U$1  AT28C256-28DIP  [DIL28-6]
U$2  AT28C256-28DIP  [DIL28-6]
U$3  AT28C256-28DIP  [DIL28-6]
U$4  AT28C256-28DIP  [DIL28-6]
U$5  AT28C256-28DIP  [DIL28-6]
U$6  AT28C256-28DIP  [DIL28-6]
U$7  AT28C256-28DIP  [DIL28-6]
U$8  AT28C256-28DIP  [DIL28-6]
U$9  AT28C256-28DIP  [DIL28-6]
U$10  AT28C256-28DIP  [DIL28-6]
U$11  AT28C256-28DIP  [DIL28-6]
U$12  AT28C256-28DIP  [DIL28-6]

## Nets
45435: IC18.5(B:I1) IC70.4(D0) IC81.5(B:I1) IC155.7(1Y)
345345: IC70.2(D2) IC72.4(B:I0) IC156.7(1Y)
634354: IC18.4(B:I0) IC70.3(D1) IC155.9(2Y)
654654: IC122.7(A6) IC227.16(Q7)
4654654: IC70.1(D3) IC72.5(B:I1) IC156.9(2Y)
5434534: IC122.6(A5) IC227.15(Q6)
AD0: IC28.18(Y1)
AD1: IC28.17(Y2)
AD2: IC28.16(Y3)
AD3: IC28.15(Y4)
AD7: IC28.11(Y8)
AD8: IC29.18(Y1)
AD9: IC29.17(Y2)
AD10: IC29.16(Y3)
AD11: IC29.15(Y4)
AD15: IC29.11(Y8)
AH_OUT: IC102.1(G1) IC102.19(G2)
AH_WRT: IC123.1(G)
AL_OUT: IC117.1(G1) IC117.19(G2)
AL_WRT: IC1.1(G)
ALU_0: IC14.9(F0) IC257.2(1A)
ALU_1: IC14.10(F1) IC257.5(2A)
ALU_2: IC14.11(F2) IC257.11(3A)
ALU_3: IC14.13(F3) IC257.14(4A)
ALU_4: IC15.9(F0) IC258.2(1A)
ALU_5: IC15.10(F1) IC258.5(2A)
ALU_6: IC15.11(F2) IC258.11(3A)
ALU_7: IC15.13(F3) IC257.3(1B) IC257.6(2B) IC257.10(3B) IC257.13(4B) IC258.3(1B) IC258.6(2B) IC258.10(3B) IC258.13(4B) IC258.14(4A)
ALU_CF_IN_SRC0: IC167.1(!A!/B)
ALU_CF_IN_SRC1: IC56.14(A)
ALU_CF_IN_SRC2: IC56.2(B)
ALU_CF_OUT_INV: IC58.1(A:I0)
ALU_FINAL_CF: IC58.3(A:O) IC126.4(2D) IC155.12(2C2) IC243.5(1C1)
ALU_MODE: IC14.8(M) IC15.8(M)
ALU_OP0: IC14.6(S0) IC15.6(S0) IC131.3(A:I1) IC138.13(A:I2)
ALU_OP1: IC14.5(S1) IC15.5(S1) IC65.2(A:I0) IC141.13(A:I2)
ALU_OP2: IC14.4(S2) IC15.4(S2) IC65.3(A:I1) IC141.1(A:I0)
ALU_OP3: IC14.3(S3) IC15.3(S3) IC131.2(A:I0) IC138.2(A:I1)
ALU_OUT_SRC: IC257.1(!A!/B) IC258.1(!A!/B)
AUX_FLAGS_OUT: IC116.1(G1) IC116.19(G2)
AUX_FLAGS_WRT: IC128.1(M) IC128.2(N) IC144.1(M) IC144.2(N)
BH_OUT: IC3.1(G1) IC3.19(G2)
BH_WRT: IC153.1(G)
BL_OUT: IC9.1(G1) IC9.19(G2)
BL_WRT: IC100.1(G)
BPH_OUT: IC114.1(G1)
BPH_WRT: IC99.1(G)
BPL_OUT: IC113.1(G1)
BPL_WRT: IC98.1(G)
CF: IC122.3(A2) IC155.10(2C0) IC167.2(1A) IC227.5(Q2) IC243.6(1C0)
CF_FROM_ALU: IC15.16(CN+4) IC58.2(A:I1)
CF_FROM_SHR_MACHINE: IC93.2(1Q) IC103.2(A1) IC243.4(1C2)
CF_IN_SRC_0: IC243.14(A)
CF_IN_SRC_1: IC243.2(B)
CH_OUT: IC146.1(G1) IC146.19(G2)
CH_WRT: IC185.1(G)
CL_OUT: IC2.1(G1) IC2.19(G2)
CL_WRT: IC101.1(G)
CLK: IC7.11(CLK) IC57.4(B:O) IC60.11(CLK) IC61.11(CLK) IC62.11(CLK) IC75.11(CLK) IC76.11(CLK) IC77.11(CLK) IC78.11(CLK) IC79.11(CLK) IC128.7(CLK) IC134.11(CLK) IC135.11(CLK) IC136.11(CLK) IC137.11(CLK) IC139.14(D1) IC144.7(CLK) IC162.11(CLK) IC189.11(CLK) IC204.3(A:CLK) IC248.7(CLK) IC249.7(CLK)
COND_0: IC70.11(A)
COND_1: IC70.10(B)
COND_2: IC70.9(C)
COND_SRC_0: IC155.14(A) IC156.14(A)
COND_SRC_1: IC155.2(B) IC156.2(B)
CONDITION: IC70.5(Y) IC74.5(B:I1)
CPU_MEM_IO: IC60.6(Q3) IC69.15(B:A3)
CPU_RD: IC60.2(Q1) IC69.11(B:A1)
CPU_WR: IC60.5(Q2) IC69.13(B:A2)
CS_H_OUT: IC140.1(G1) IC140.19(G2)
CS_H_WRT: IC173.1(G)
CS_L_OUT: IC210.1(G1) IC210.19(G2)
CS_L_WRT: IC205.1(G)
DATA0: IC118.3(1D) IC169.3(1D) IC179.18(A:Y1)
DATA1: IC118.4(2D) IC169.4(2D) IC179.16(A:Y2)
DATA2: IC169.7(3D) IC179.14(A:Y3)
DATA3: IC169.8(4D) IC179.12(A:Y4)
DATA4: IC169.13(5D) IC178.18(A:Y1)
DATA5: IC169.14(6D) IC178.16(A:Y2)
DATA6: IC169.17(7D) IC178.14(A:Y3)
DATA7: IC169.18(8D) IC178.12(A:Y4)
DH_OUT: IC145.1(G1) IC145.19(G2)
DH_WRT: IC184.1(G)
DL_OUT: IC245.1(G1) IC245.19(G2)
DMA_ACK: IC116.2(A1) IC144.3(Q1)
DMA_REQ: IC204.5(A:Q)
DMA_TRISTATE: IC28.1(G1) IC28.19(G2) IC29.1(G1) IC29.19(G2) IC69.19(B:G) IC116.3(A2) IC144.4(Q2) IC250.4(B:I0) IC250.6(B:O)
DS_H_OUT: IC215.1(G1) IC215.19(G2)
DS_H_WRT: IC165.1(G)
DS_L_OUT: IC171.1(G1) IC171.19(G2)
DS_L_WRT: IC166.1(G)
ENCODED_INT_STATUS_OUT: IC154.1(G1) IC154.19(G2)
ES_H_OUT: IC264.1(G1) IC264.19(G2)
ES_H_WRT: IC261.1(G)
ES_L_OUT: IC263.1(G1) IC263.19(G2)
ES_L_WRT: IC262.1(G)
FINAL_CONDITION: IC74.6(B:O) IC83.3(B:I)
FLAGS_REG_OUT: IC122.1(G1) IC122.19(G2)
GND: IC22.15(G) IC23.15(G) IC49.5(2A) IC49.11(3A) IC49.14(4A) IC49.15(G) IC50.7(C0) IC53.11(B4) IC53.12(A4) IC53.14(A3) IC53.15(B3) IC55.2(1A) IC55.5(2A) IC55.11(3A) IC55.14(4A) IC55.15(G) IC56.1(1G) IC56.6(1C0) IC56.15(2G) IC63.2(1A) IC63.5(2A) IC63.11(3A) IC63.14(4A) IC63.15(G) IC68.2(1A) IC68.5(2A) IC68.10(3B) IC68.11(3A) IC68.13(4B) IC68.14(4A) IC68.15(G) IC69.17(B:A4) IC70.7(G) IC73.3(D1) IC94.15(G) IC95.15(G) IC96.15(G) IC97.15(G) IC115.2(A1) IC115.3(A2) IC115.4(A3) IC115.5(A4) IC115.6(A5) IC115.7(A6) IC115.8(A7) IC115.9(A8) IC121.15(G) IC128.9(G1) IC128.10(G2) IC129.3(D1) IC139.9(G1) IC139.10(G2) IC142.3(D1) IC144.9(G1) IC144.10(G2) IC154.2(A1) IC154.3(A2) IC154.4(A3) IC154.8(A7) IC154.9(A8) IC155.1(1G) IC155.15(2G) IC156.1(1G) IC156.15(2G) IC159.3(D1) IC160.3(D1) IC167.15(G) IC186.3(D1) IC199.13(A:I4) IC208.4(1C2) IC226.5(EI) IC227.14(D6) IC227.17(D7) IC227.18(D8) IC248.9(G1) IC248.10(G2) IC249.9(G1) IC249.10(G2) IC255.4(1C2) IC256.4(1C2) IC258.15(G) R5.1 R6.1 R7.1 R8.1 R10.1 R11.1 R12.1 R13.1 R14.1 RN1.9 RN1.10 RN1.11 RN1.12 RN1.13 RN1.14 RN1.15 RN1.16 RN2.9 RN2.10 RN2.11 RN2.12 RN2.13 RN2.14 RN2.15 RN2.16 RN3.9 RN3.10 RN3.11 RN3.12 RN3.13 RN3.14 RN3.15 RN3.16 S1.2(P) S2.3(S) S4.3(S) U$1.1(A14) U$1.14(GND) U$1.20(/CE) U$1.22(/OE) U$1.27(/WE) U$2.1(A14) U$2.14(GND) U$2.20(/CE) U$2.22(/OE) U$2.27(/WE) U$3.1(A14) U$3.14(GND) U$3.20(/CE) U$3.22(/OE) U$3.27(/WE) U$4.1(A14) U$4.14(GND) U$4.20(/CE) U$4.22(/OE) U$4.27(/WE) U$5.1(A14) U$5.14(GND) U$5.20(/CE) U$5.22(/OE) U$5.27(/WE) U$6.1(A14) U$6.14(GND) U$6.20(/CE) U$6.22(/OE) U$6.27(/WE) U$7.1(A14) U$7.14(GND) U$7.20(/CE) U$7.22(/OE) U$7.27(/WE) U$8.1(A14) U$8.14(GND) U$8.20(/CE) U$8.22(/OE) U$8.27(/WE) U$9.1(A14) U$9.14(GND) U$9.20(/CE) U$9.22(/OE) U$9.27(/WE)
HALT: IC116.6(A5) IC128.3(Q1) IC147.5(B:I1)
IMM_X_OUT: IC115.1(G1) IC115.19(G2)
IMMY_OUT: IC19.1(G1)
INT_ACK: IC222.4(G2A) IC222.5(G2B)
INT_ENABLE: IC64.2(A:I1) IC116.4(A3) IC132.2(A:I1) IC144.5(Q3) IC150.2(A:I1) IC151.2(A:I1) IC157.2(A:I1) IC158.2(A:I1) IC191.2(A:I1)
INT_PENDING: IC202.3(A:O)
INT_REQ_1: IC163.3(A:CLK) R6.2
INT_REQ_2: IC164.3(A:CLK) R7.2
INT_REQ_3: IC168.3(A:CLK) R8.2
INT_REQ_4: IC174.3(A:CLK) R10.2
INT_REQ_5: IC188.3(A:CLK) R11.2
INT_REQ_6: IC221.3(A:CLK) R12.2
INT_REQ_7: IC187.3(A:CLK) R13.2
INTERRUPT_STATUS_OUT: IC125.1(G1) IC125.19(G2)
IO_DMA_REQ: IC204.2(A:D) R14.2
IR_0: IC34.3(D1) IC169.2(1Q)
IR_1: IC35.3(D1)
IR_2: IC36.3(D1)
IR_3: IC37.3(D1)
IR_4: IC38.3(D1)
IR_5: IC40.3(D1)
IR_6: IC41.3(D1)
IR_7: IC71.3(D1) IC169.19(8Q)
IR_8: IC118.2(1Q)
IR_9: IC118.5(2Q)
IR_H_WRT: IC118.1(G)
IR_L_WRT: IC169.1(G)
MARH_WRT: IC7.1(G)
MARH_X_OUT: IC24.19(B:G) IC25.19(B:G)
MARL_0: IC27.11(B:A1) IC28.2(A1) IC189.2(1Q)
MARL_1: IC27.13(B:A2) IC28.3(A2) IC189.5(2Q)
MARL_WRT: IC189.1(G)
MARL_X_OUT: IC26.19(B:G) IC27.19(B:G)
MASK_0: IC244.11(B:A1) IC248.3(Q1)
MASK_1: IC152.9(C:I0) IC244.13(B:A2) IC248.4(Q2)
MASK_2: IC201.9(C:I0) IC244.15(B:A3) IC248.5(Q3)
MASK_3: IC203.9(C:I0) IC244.17(B:A4) IC248.6(Q4)
MASK_4: IC206.9(C:I0) IC247.11(B:A1) IC249.3(Q1)
MASK_5: IC228.9(C:I0) IC247.13(B:A2) IC249.4(Q2)
MASK_6: IC190.9(C:I0) IC247.15(B:A3) IC249.5(Q3)
MASK_7: IC242.9(C:I0)
MASK_ENABLE: IC116.5(A4) IC144.6(Q4) IC152.10(C:I1) IC190.10(C:I1) IC201.10(C:I1) IC203.10(C:I1) IC206.10(C:I1) IC228.10(C:I1) IC242.10(C:I1)
MASK_FLAGS_OUT: IC244.19(B:G) IC247.19(B:G)
MASK_FLAGS_WRT: IC248.1(M) IC248.2(N) IC249.1(M) IC249.2(N)
MDR_IN_BUS0: IC21.3(1D) IC180.3(1D)
MDR_IN_BUS1: IC21.4(2D) IC180.4(2D)
MDR_IN_BUS2: IC21.7(3D) IC180.7(3D)
MDR_IN_BUS3: IC21.8(4D) IC180.8(4D)
MDR_IN_BUS4: IC21.13(5D) IC180.13(5D)
MDR_IN_BUS5: IC21.14(6D) IC180.14(6D)
MDR_IN_BUS6: IC21.17(7D) IC180.17(7D)
MDR_IN_BUS7: IC21.18(8D) IC180.18(8D)
MDR_IN_SRC: IC22.1(!A!/B) IC23.1(!A!/B)
MDRH_DATA_OUT: IC178.1(A:G) IC179.1(A:G)
MDRH_WRT: IC180.1(G)
MDRH_X_OUT: IC176.1(A:G) IC181.1(A:G)
MDRH_Y_OUT: IC182.1(A:G) IC183.1(A:G)
MDRL_DATA_OUT: IC30.1(A:G) IC31.1(A:G)
MDRL_WRT: IC21.1(G)
MDRL_X_OUT: IC12.1(A:G) IC13.1(A:G)
MDRL_Y_OUT: IC10.1(A:G) IC11.1(A:G)
MEM_IO: IC69.5(B:Y3) RN4.14
N$1: IC1.2(1Q) IC117.2(A1)
N$2: IC1.5(2Q) IC117.3(A2)
N$3: IC1.6(3Q) IC117.4(A3)
N$4: IC1.9(4Q) IC117.5(A4)
N$5: IC1.12(5Q) IC117.6(A5)
N$6: IC1.15(6Q) IC117.7(A6)
N$7: IC102.8(A7) IC123.16(7Q)
N$8: IC1.19(8Q) IC117.9(A8)
N$9: IC139.1(M) IC139.2(N) IC147.6(B:O)
N$10: IC80.6(B:O) IC133.2(A:I1)
N$11: IC82.19(8Q) IC95.10(3B) IC104.9(A8) IC161.1(A:I0)
N$12: IC49.4(1Y) IC50.6(B1)
N$13: IC9.2(A1) IC100.2(1Q)
N$14: IC49.7(2Y) IC50.2(B2)
N$15: IC9.3(A2) IC100.5(2Q)
N$16: IC9.4(A3) IC100.6(3Q)
N$17: IC9.5(A4) IC100.9(4Q)
N$18: IC9.6(A5) IC100.12(5Q)
N$19: IC9.7(A6) IC100.15(6Q)
N$20: IC9.8(A7) IC100.16(7Q)
N$21: IC9.9(A8) IC100.19(8Q)
N$22: IC56.3(1C3) IC57.2(A:O)
N$23: IC65.1(A:O) IC138.1(A:I0)
N$24: IC143.3(A:O) IC170.5(B:I1)
N$25: IC2.2(A1) IC101.2(1Q)
N$26: IC2.3(A2) IC101.5(2Q)
N$27: IC2.4(A3) IC101.6(3Q)
N$28: IC2.5(A4) IC101.9(4Q)
N$29: IC2.6(A5) IC101.12(5Q)
N$30: IC2.7(A6) IC101.15(6Q)
N$31: IC2.8(A7) IC101.16(7Q)
N$32: IC2.9(A8) IC101.19(8Q)
N$33: IC56.4(1C2) IC57.1(A:I) IC167.4(1Y)
N$34: IC131.1(A:O) IC141.2(A:I1)
N$35: IC49.9(3Y) IC50.15(B3)
N$36: IC49.12(4Y) IC50.11(B4)
N$37: IC51.6(B1) IC55.4(1Y)
N$38: IC51.2(B2) IC55.7(2Y)
N$39: IC51.15(B3) IC55.9(3Y)
N$40: IC51.11(B4) IC55.12(4Y)
N$41: IC227.3(D1) IC241.7(1Y)
N$42: IC179.2(A:A1) IC180.2(1Q) IC181.2(A:A1) IC182.2(A:A1)
N$43: IC179.4(A:A2) IC180.5(2Q) IC181.4(A:A2) IC182.4(A:A2)
N$44: IC179.6(A:A3) IC180.6(3Q) IC181.6(A:A3) IC182.6(A:A3)
N$45: IC179.8(A:A4) IC180.9(4Q) IC181.8(A:A4) IC182.8(A:A4)
N$46: IC176.2(A:A1) IC178.2(A:A1) IC180.12(5Q) IC183.2(A:A1)
N$47: IC176.4(A:A2) IC178.4(A:A2) IC180.15(6Q) IC183.4(A:A2)
N$48: IC176.6(A:A3) IC178.6(A:A3) IC180.16(7Q) IC183.6(A:A3)
N$49: IC116.7(A6) IC128.4(Q2)
N$50: IC66.2(A:I0) IC130.6(B:O) IC143.2(A:I1)
N$51: IC176.8(A:A4) IC178.8(A:A4) IC180.19(8Q) IC183.8(A:A4)
N$52: IC27.15(B:A3) IC28.4(A3) IC189.6(3Q)
N$53: IC27.17(B:A4) IC28.5(A4) IC189.9(4Q)
N$54: IC26.11(B:A1) IC28.6(A5) IC189.12(5Q)
N$55: IC26.13(B:A2) IC28.7(A6) IC189.15(6Q)
N$56: IC26.15(B:A3) IC28.8(A7) IC189.16(7Q)
N$57: IC26.17(B:A4) IC28.9(A8) IC189.19(8Q)
N$58: IC7.2(1Q) IC25.11(B:A1) IC29.2(A1)
N$59: IC7.5(2Q) IC25.13(B:A2) IC29.3(A2)
N$60: IC7.6(3Q) IC25.15(B:A3) IC29.4(A3)
N$61: IC7.9(4Q) IC25.17(B:A4) IC29.5(A4)
N$62: IC7.12(5Q) IC24.11(B:A1) IC29.6(A5)
N$63: IC7.15(6Q) IC24.13(B:A2) IC29.7(A6)
N$64: IC7.16(7Q) IC24.15(B:A3) IC29.8(A7)
N$65: IC52.6(B1) IC63.4(1Y)
N$66: IC122.8(A7) IC227.19(Q8)
N$67: IC5.2(1Q) IC109.11(B:A1)
N$68: IC5.5(2Q) IC109.13(B:A2)
N$69: IC5.6(3Q) IC109.15(B:A3)
N$70: IC5.9(4Q) IC109.17(B:A4)
N$71: IC5.12(5Q) IC110.11(B:A1)
N$72: IC5.15(6Q) IC110.13(B:A2)
N$73: IC7.19(8Q) IC24.17(B:A4) IC29.9(A8)
N$74: IC52.2(B2) IC63.7(2Y)
N$75: IC52.15(B3) IC63.9(3Y)
N$76: IC44.3(A:CLK) IC139.7(CLK) SW3.C
N$77: IC75.3(D1) U$1.11(I/O0)
N$78: IC39.1(A:I0) IC43.4(B:O) IC45.1(A:I0)
N$79: IC32.3(D1) IC186.5(Y)
N$80: IC83.4(B:O) IC85.13(A:I2)
N$81: IC82.2(1Q) IC94.13(4B) IC104.2(A1)
N$82: IC66.1(A:O) IC170.4(B:I0)
N$83: IC10.2(A:A1) IC13.2(A:A1) IC21.2(1Q) IC30.2(A:A1)
N$84: IC133.1(A:I0) IC170.6(B:O)
N$85: IC66.3(A:I1) IC138.12(A:O)
N$86: IC59.1(A:I) IC209.6(B:O)
N$87: IC145.2(A1) IC184.2(1Q)
N$88: IC227.4(D2) IC243.7(1Y)
N$89: IC141.12(A:O) IC143.1(A:I0)
N$90: IC227.7(D3) IC255.7(1Y)
N$91: IC46.5(B:I1) IC47.3(A:O)
N$92: IC227.8(D4) IC256.7(1Y)
N$93: IC208.7(1Y) IC227.13(D5)
N$94: IC46.4(B:I0) IC119.4(B:O)
N$95: IC46.6(B:O) IC124.2(A:I1)
N$96: IC124.3(A:O) IC126.3(1D)
N$97: IC32.4(D2) IC160.5(Y)
N$98: IC257.4(1Y) RN5.16
N$99: IC257.7(2Y) RN5.15
N$100: IC257.9(3Y) RN5.14
N$101: IC257.12(4Y) RN5.13
N$102: IC258.4(1Y) RN5.12
N$103: IC258.7(2Y) RN5.11
N$104: IC258.9(3Y) RN5.10
N$105: IC258.12(4Y) RN5.9
N$106: IC99.19(8Q) IC114.9(A8)
N$107: IC14.16(CN+4) IC15.7(CN)
N$108: IC95.13(4B) IC161.3(A:O)
N$109: IC145.3(A2) IC184.5(2Q)
N$110: IC1.16(7Q) IC117.8(A7)
N$111: IC145.4(A3) IC184.6(3Q)
N$112: IC145.5(A4) IC184.9(4Q)
N$113: IC32.7(D3) IC159.5(Y)
N$114: IC86.2(1Q) IC89.2(A:A1)
N$115: IC86.5(2Q) IC89.4(A:A2)
N$116: IC86.6(3Q) IC89.6(A:A3)
N$117: IC86.9(4Q) IC89.8(A:A4)
N$118: IC86.12(5Q) IC90.2(A:A1)
N$119: IC86.15(6Q) IC90.4(A:A2)
N$120: IC86.16(7Q) IC90.6(A:A3)
N$121: IC86.19(8Q) IC90.8(A:A4)
N$122: IC88.2(1Q) IC91.2(A:A1)
N$123: IC88.5(2Q) IC91.4(A:A2)
N$124: IC88.6(3Q) IC91.6(A:A3)
N$125: IC88.9(4Q) IC91.8(A:A4)
N$126: IC88.12(5Q) IC92.2(A:A1)
N$127: IC88.15(6Q) IC92.4(A:A2)
N$128: IC88.16(7Q) IC92.6(A:A3)
N$129: IC88.19(8Q) IC92.8(A:A4)
N$130: IC42.2(A:I1) IC67.6(B:O)
N$131: IC93.3(1D) IC96.4(1Y)
N$132: IC10.4(A:A2) IC13.4(A:A2) IC21.5(2Q) IC30.4(A:A2)
N$133: IC45.3(A:O) IC67.5(B:I1)
N$134: IC10.6(A:A3) IC13.6(A:A3) IC21.6(3Q) IC30.6(A:A3)
N$135: IC145.6(A5) IC184.12(5Q)
N$136: IC145.7(A6) IC184.15(6Q)
N$137: IC10.8(A:A4) IC13.8(A:A4) IC21.9(4Q) IC30.8(A:A4)
N$138: IC11.2(A:A1) IC12.2(A:A1) IC21.12(5Q) IC31.2(A:A1)
N$139: IC145.8(A7) IC184.16(7Q)
N$140: IC11.4(A:A2) IC12.4(A:A2) IC21.15(6Q) IC31.4(A:A2)
N$141: IC11.6(A:A3) IC12.6(A:A3) IC21.16(7Q) IC31.6(A:A3)
N$142: IC145.9(A8) IC184.19(8Q)
N$143: IC5.16(7Q) IC110.15(B:A3)
N$144: IC52.11(B4) IC63.12(4Y)
N$145: IC53.6(B1) IC68.4(1Y)
N$146: IC5.19(8Q) IC110.17(B:A4)
N$147: IC53.2(B2) IC68.7(2Y)
N$148: IC93.4(2D) IC96.7(2Y)
N$149: IC93.7(3D) IC96.9(3Y)
N$150: IC55.13(4B) IC63.3(1B) IC63.6(2B) IC63.10(3B) IC63.13(4B) IC68.3(1B) IC68.6(2B)
N$151: IC4.2(1Q) IC111.11(B:A1)
N$152: IC49.1(!A!/B) IC55.1(!A!/B) IC63.1(!A!/B) IC68.1(!A!/B) IC85.12(A:O)
N$153: IC32.8(D4) IC142.5(Y)
N$154: IC84.4(B:O) IC85.2(A:I1)
N$155: IC116.8(A7) IC128.5(Q3)
N$156: IC93.8(4D) IC96.12(4Y)
N$157: IC93.13(5D) IC94.4(1Y)
N$158: IC93.14(6D) IC94.7(2Y)
N$159: IC93.17(7D) IC94.9(3Y)
N$160: IC93.18(8D) IC94.12(4Y)
N$161: IC82.3(1D) IC97.4(1Y)
N$162: IC82.4(2D) IC97.7(2Y)
N$163: IC82.7(3D) IC97.9(3Y)
N$164: IC11.8(A:A4) IC12.8(A:A4) IC21.19(8Q) IC31.8(A:A4)
N$165: IC82.8(4D) IC97.12(4Y)
N$166: IC82.13(5D) IC95.4(1Y)
N$167: SW3.2
N$168: IC82.14(6D) IC95.7(2Y)
N$169: IC10.18(A:Y1)
N$170: IC10.16(A:Y2)
N$171: IC10.14(A:Y3)
N$172: IC10.12(A:Y4)
N$173: IC82.17(7D) IC95.9(3Y)
N$174: IC32.13(D5) IC129.5(Y)
N$175: IC32.14(D6) IC73.5(Y)
N$176: IC14.7(CN) IC56.7(1Y)
N$177: IC13.18(A:Y1)
N$178: IC13.16(A:Y2)
N$179: IC13.14(A:Y3)
N$180: IC13.12(A:Y4)
N$181: IC12.18(A:Y1)
N$182: IC12.16(A:Y2)
N$183: IC12.14(A:Y3)
N$184: IC12.12(A:Y4)
N$185: IC32.17(D7) IC34.5(Y)
N$186: IC32.18(D8) IC35.5(Y)
N$187: IC33.3(D1) IC36.5(Y)
N$188: IC33.4(D2) IC37.5(Y)
N$189: IC33.7(D3) IC38.5(Y)
N$190: IC33.8(D4) IC40.5(Y)
N$191: IC22.7(2Y)
N$192: IC22.9(3Y)
N$193: IC22.12(4Y)
N$194: IC23.4(1Y)
N$195: IC23.7(2Y)
N$196: IC23.9(3Y)
N$197: IC23.12(4Y)
N$198: IC22.3(1B)
N$199: IC22.6(2B)
N$200: IC30.18(A:Y1)
N$201: IC30.16(A:Y2)
N$202: IC82.18(8D) IC95.12(4Y)
N$203: IC30.14(A:Y3)
N$204: IC30.12(A:Y4)
N$205: IC82.16(7Q) IC95.6(2B) IC104.8(A7)
N$206: IC31.18(A:Y1)
N$207: IC31.16(A:Y2)
N$208: IC31.14(A:Y3)
N$209: IC31.12(A:Y4)
N$210: IC22.4(1Y)
N$211: IC22.10(3B)
N$212: IC22.13(4B)
N$213: IC23.3(1B)
N$214: IC23.6(2B)
N$215: IC23.10(3B)
N$216: IC23.13(4B)
N$217: IC116.9(A8) IC128.6(Q4)
N$218: IC33.13(D5) IC41.5(Y)
N$219: IC33.14(D6) IC71.5(Y)
N$220: IC148.3(A:O) IC162.3(D1)
N$221: IC102.6(A5) IC123.12(5Q)
N$222: IC195.2(A:I1) IC222.15(Y0)
N$223: IC8.1(A:CLR) IC195.3(A:O)
N$224: IC8.5(A:Q) IC148.2(A:I1)
N$225: IC20.5(Y) IC33.17(D7)
N$226: IC196.4(B:O) IC226.4
N$227: IC39.3(A:O)
N$228: IC33.18(D8) IC172.5(Y)
N$229: IC102.7(A6) IC123.15(6Q)
N$230: IC205.2(1Q) IC210.2(A1)
N$231: IC120.3(A:O) IC241.4(1C2)
N$232: IC82.15(6Q) IC95.3(1B) IC104.7(A6)
N$233: IC82.12(5Q) IC97.13(4B) IC104.6(A5)
N$234: IC205.5(2Q) IC210.3(A2)
N$235: IC102.9(A8) IC123.19(8Q)
N$236: IC102.2(A1) IC123.2(1Q)
N$237: IC102.3(A2) IC123.5(2Q)
N$238: IC102.4(A3) IC123.6(3Q)
N$239: IC205.6(3Q) IC210.4(A3)
N$240: IC205.9(4Q) IC210.5(A4)
N$241: IC205.12(5Q) IC210.6(A5)
N$242: IC205.15(6Q) IC210.7(A6)
N$243: IC205.16(7Q) IC210.8(A7)
N$244: IC205.19(8Q) IC210.9(A8)
N$245: IC140.2(A1) IC173.2(1Q)
N$246: IC140.3(A2) IC173.5(2Q)
N$247: IC140.4(A3) IC173.6(3Q)
N$248: IC140.5(A4) IC173.9(4Q)
N$249: IC102.5(A4) IC123.9(4Q)
N$250: IC140.6(A5) IC173.12(5Q)
N$251: U$2.10(A0)
N$252: U$2.9(A1)
N$253: U$2.8(A2)
N$254: U$2.7(A3)
N$255: U$2.6(A4)
N$256: U$2.5(A5)
N$257: U$2.4(A6)
N$258: U$2.3(A7)
N$259: U$2.25(A8)
N$260: U$2.24(A9)
N$261: U$2.21(A10)
N$262: U$2.23(A11)
N$263: U$2.2(A12)
N$264: U$2.26(A13)
N$265: U$3.10(A0)
N$266: U$3.9(A1)
N$267: U$3.8(A2)
N$268: U$3.7(A3)
N$269: U$3.6(A4)
N$270: U$3.5(A5)
N$271: U$3.4(A6)
N$272: U$3.3(A7)
N$273: U$3.25(A8)
N$274: U$3.24(A9)
N$275: U$3.21(A10)
N$276: U$3.23(A11)
N$277: U$3.2(A12)
N$278: U$3.26(A13)
N$279: U$4.10(A0)
N$280: U$4.9(A1)
N$281: U$4.8(A2)
N$282: U$4.7(A3)
N$283: U$4.6(A4)
N$284: U$4.5(A5)
N$285: U$4.4(A6)
N$286: U$4.3(A7)
N$287: U$4.25(A8)
N$288: U$4.24(A9)
N$289: U$4.21(A10)
N$290: U$4.23(A11)
N$291: U$4.2(A12)
N$292: U$4.26(A13)
N$293: U$5.10(A0)
N$294: U$5.9(A1)
N$295: U$5.8(A2)
N$296: U$5.7(A3)
N$297: U$5.6(A4)
N$298: U$5.5(A5)
N$299: U$5.4(A6)
N$300: U$5.3(A7)
N$301: U$5.25(A8)
N$302: U$5.24(A9)
N$303: U$5.21(A10)
N$304: U$5.23(A11)
N$305: U$5.2(A12)
N$306: U$5.26(A13)
N$307: IC140.7(A6) IC173.15(6Q)
N$308: IC140.8(A7) IC173.16(7Q)
N$309: IC140.9(A8) IC173.19(8Q)
N$310: IC166.2(1Q) IC171.2(A1)
N$311: IC166.5(2Q) IC171.3(A2)
N$312: IC82.9(4Q) IC97.10(3B) IC104.5(A4)
N$313: IC82.6(3Q) IC97.6(2B) IC104.4(A3)
N$314: IC82.5(2Q) IC97.3(1B) IC104.3(A2)
N$315: IC166.6(3Q) IC171.4(A3)
N$316: IC93.19(8Q) IC94.10(3B) IC103.9(A8)
N$317: IC93.16(7Q) IC94.6(2B) IC103.8(A7)
N$318: IC93.15(6Q) IC94.3(1B) IC103.7(A6)
N$319: IC93.12(5Q) IC96.13(4B) IC103.6(A5)
N$320: IC154.7(A6) IC226.9(A0)
N$321: IC93.9(4Q) IC96.10(3B) IC103.5(A4)
N$322: IC175.6(B:O) IC177.4(B:I0)
N$323: IC93.6(3Q) IC96.6(2B) IC103.4(A3)
N$324: IC177.6(B:O) IC192.4(B:I0)
N$325: IC3.2(A1) IC153.2(1Q)
N$326: IC3.3(A2) IC153.5(2Q)
N$327: IC3.4(A3) IC153.6(3Q)
N$328: IC3.5(A4) IC153.9(4Q)
N$329: IC3.6(A5) IC153.12(5Q)
N$330: IC3.7(A6) IC153.15(6Q)
N$331: IC3.8(A7) IC153.16(7Q)
N$332: IC3.9(A8) IC153.19(8Q)
N$333: IC50.5(A1)
N$334: IC50.3(A2)
N$335: IC50.14(A3)
N$336: IC50.12(A4)
N$337: IC52.5(A1)
N$338: IC51.5(A1)
N$339: IC51.3(A2)
N$340: IC51.14(A3)
N$341: IC51.12(A4)
N$342: IC146.2(A1) IC185.2(1Q)
N$343: IC93.5(2Q) IC96.3(1B) IC103.3(A2)
N$344: IC166.9(4Q) IC171.5(A4)
N$345: IC166.12(5Q) IC171.6(A5)
N$346: IC158.1(A:I0) IC190.8(C:O)
N$347: IC121.3(1B) IC127.3(A:O)
N$348: IC125.2(A1) IC162.2(Q1) IC196.3(B:I)
N$349: IC149.3(B:I) IC226.14(GS)
N$350: IC52.3(A2)
N$351: IC52.14(A3)
N$352: IC52.12(A4)
N$353: IC53.5(A1)
N$354: IC53.3(A2)
N$355: IC158.12(A:O) IC226.11
N$356: IC149.4(B:O) IC202.2(A:I1)
N$357: IC50.9(C4) IC51.7(C0)
N$358: IC51.9(C4) IC52.7(C0)
N$359: IC52.9(C4) IC53.7(C0)
N$360: IC76.5(Q2)
N$361: IC202.1(A:I0) IC226.15(EO)
N$362: IC192.6(B:O) IC193.4(B:I0)
N$363: IC166.15(6Q) IC171.7(A6)
N$364: IC76.6(Q3)
N$365: IC64.12(A:O) IC226.3
N$366: IC64.13(A:I2) IC125.3(A2) IC162.5(Q2)
N$367: IC75.4(D2) U$1.12(I/O1)
N$368: IC132.1(A:I0) IC201.8(C:O)
N$369: IC75.7(D3) U$1.13(I/O2)
N$370: IC166.16(7Q) IC171.8(A7)
N$371: IC166.19(8Q) IC171.9(A8)
N$372: IC168.1(A:CLR) IC220.3(A:O)
N$373: IC146.3(A2) IC185.5(2Q)
N$374: IC174.1(A:CLR) IC223.3(A:O)
N$375: IC75.8(D4) U$1.15(I/O3)
N$376: IC75.13(D5) U$1.16(I/O4)
N$377: IC75.14(D6) U$1.17(I/O5)
N$378: IC60.3(D1) U$10.11(I/O0)
N$379: IC60.4(D2) U$10.12(I/O1)
N$380: IC60.7(D3) U$10.13(I/O2)
N$381: IC60.8(D4) U$10.15(I/O3)
N$382: IC60.13(D5) U$10.16(I/O4)
N$383: IC60.14(D6) U$10.17(I/O5)
N$384: IC60.17(D7) U$10.18(I/O6)
N$385: IC60.18(D8) U$10.19(I/O7)
N$386: IC61.3(D1) U$11.11(I/O0)
N$387: IC61.4(D2) U$11.12(I/O1)
N$388: IC188.1(A:CLR) IC224.3(A:O)
N$389: IC162.18(D8) IC187.5(A:Q)
N$390: IC162.4(D2) IC163.5(A:Q)
N$391: IC76.9(Q4)
N$392: IC162.7(D3) IC164.5(A:Q)
N$393: IC162.8(D4) IC168.5(A:Q)
N$394: IC162.13(D5) IC174.5(A:Q)
N$395: IC162.14(D6) IC188.5(A:Q)
N$396: IC162.17(D7) IC221.5(A:Q)
N$397: IC207.1(A:I0) IC222.7(Y7)
N$398: IC218.2(A:I1) IC222.14(Y1)
N$399: IC219.2(A:I1) IC222.13(Y2)
N$400: IC76.12(Q5)
N$401: IC76.15(Q6)
N$402: IC76.16(Q7)
N$403: IC222.11(Y4) IC223.1(A:I0)
N$404: IC4.5(2Q) IC111.13(B:A2)
N$405: IC222.9(Y6) IC225.1(A:I0)
N$406: IC187.1(A:CLR) IC207.3(A:O)
N$408: IC163.1(A:CLR) IC218.3(A:O)
N$409: IC164.1(A:CLR) IC219.3(A:O)
N$410: IC221.1(A:CLR) IC225.3(A:O)
N$411: IC125.4(A3) IC132.13(A:I2) IC162.6(Q3)
N$412: IC125.5(A4) IC150.13(A:I2) IC162.9(Q4)
N$413: IC132.12(A:O) IC226.2
N$414: IC125.6(A5) IC151.13(A:I2) IC162.12(Q5)
N$415: IC150.1(A:I0) IC203.8(C:O)
N$416: IC150.12(A:O) IC226.1
N$417: IC151.1(A:I0) IC206.8(C:O)
N$418: IC151.12(A:O) IC226.13
N$419: IC157.1(A:I0) IC228.8(C:O)
N$420: IC157.12(A:O) IC226.12
N$421: IC191.1(A:I0) IC242.8(C:O)
N$422: IC146.4(A3) IC185.6(3Q)
N$423: IC146.5(A4) IC185.9(4Q)
N$424: IC146.6(A5) IC185.12(5Q)
N$425: IC146.7(A6) IC185.15(6Q)
N$426: IC146.8(A7) IC185.16(7Q)
N$427: IC146.9(A8) IC185.19(8Q)
N$428: IC216.2(1Q) IC245.2(A1)
N$429: IC216.5(2Q) IC245.3(A2)
N$430: IC216.6(3Q) IC245.4(A3)
N$431: IC216.9(4Q) IC245.5(A4)
N$432: IC216.12(5Q) IC245.6(A5)
N$433: IC216.15(6Q) IC245.7(A6)
N$434: IC216.16(7Q) IC245.8(A7)
N$435: IC216.19(8Q) IC245.9(A8)
N$436: IC191.12(A:O) IC226.10
N$437: IC125.7(A6) IC157.13(A:I2) IC162.15(Q6)
N$438: IC125.8(A7) IC158.13(A:I2) IC162.16(Q7)
N$439: IC125.9(A8) IC162.19(Q8) IC191.13(A:I2)
N$440: IC76.19(Q8)
N$441: IC165.2(1Q) IC215.2(A1)
N$442: IC76.3(D1) U$2.11(I/O0)
N$443: IC76.4(D2) U$2.12(I/O1)
N$444: IC247.17(B:A4) IC249.6(Q4)
N$445: IC193.6(B:O) IC194.4(B:I0)
N$446: IC197.5(A:O) IC198.1(A:I)
N$447: IC77.5(Q2)
N$448: IC61.7(D3) U$11.13(I/O2)
N$449: IC75.17(D7) U$1.18(I/O6)
N$450: IC75.18(D8) U$1.19(I/O7)
N$451: IC76.7(D3) U$2.13(I/O2)
N$452: IC76.8(D4) U$2.15(I/O3)
N$453: IC76.13(D5) U$2.16(I/O4)
N$454: IC76.14(D6) U$2.17(I/O5)
N$455: IC76.17(D7) U$2.18(I/O6)
N$456: IC76.18(D8) U$2.19(I/O7)
N$457: IC77.3(D1) U$3.11(I/O0)
N$458: IC77.4(D2) U$3.12(I/O1)
N$459: IC77.7(D3) U$3.13(I/O2)
N$460: IC77.8(D4) U$3.15(I/O3)
N$461: IC77.13(D5) U$3.16(I/O4)
N$462: IC77.14(D6) U$3.17(I/O5)
N$463: IC77.17(D7) U$3.18(I/O6)
N$464: IC77.18(D8) U$3.19(I/O7)
N$465: IC78.3(D1) U$4.11(I/O0)
N$466: IC78.4(D2) U$4.12(I/O1)
N$467: IC78.7(D3) U$4.13(I/O2)
N$468: IC78.8(D4) U$4.15(I/O3)
N$469: IC78.13(D5) U$4.16(I/O4)
N$470: IC78.14(D6) U$4.17(I/O5)
N$471: IC78.17(D7) U$4.18(I/O6)
N$472: IC78.18(D8) U$4.19(I/O7)
N$473: IC79.3(D1) U$5.11(I/O0)
N$474: IC79.4(D2) U$5.12(I/O1)
N$475: IC79.7(D3) U$5.13(I/O2)
N$476: IC79.8(D4) U$5.15(I/O3)
N$477: IC79.13(D5) U$5.16(I/O4)
N$478: IC79.14(D6) U$5.17(I/O5)
N$479: IC79.17(D7) U$5.18(I/O6)
N$480: IC79.18(D8) U$5.19(I/O7)
N$481: IC198.2(A:O) IC199.1(A:I0)
N$482: IC61.8(D4) U$11.15(I/O3)
N$483: IC61.13(D5) U$11.16(I/O4)
N$484: IC61.14(D6) U$11.17(I/O5)
N$485: IC61.17(D7) U$11.18(I/O6)
N$486: IC61.18(D8) U$11.19(I/O7)
N$487: IC62.3(D1) U$12.11(I/O0)
N$488: IC62.4(D2) U$12.12(I/O1)
N$489: IC62.7(D3) U$12.13(I/O2)
N$490: IC62.8(D4) U$12.15(I/O3)
N$491: IC62.13(D5) U$12.16(I/O4)
N$492: IC62.14(D6) U$12.17(I/O5)
N$493: IC62.17(D7) U$12.18(I/O6)
N$494: IC62.18(D8) U$12.19(I/O7)
N$495: IC194.6(B:O) IC200.4(B:I0)
N$496: IC200.6(B:O) IC209.4(B:I0)
N$497: IC165.5(2Q) IC215.3(A2)
N$498: IC165.6(3Q) IC215.4(A3)
N$499: IC165.9(4Q) IC215.5(A4)
N$500: IC165.12(5Q) IC215.6(A5)
N$501: IC165.15(6Q) IC215.7(A6)
N$502: IC165.16(7Q) IC215.8(A7)
N$503: IC134.18(D8) U$6.19(I/O7)
N$504: IC134.17(D7) U$6.18(I/O6)
N$505: IC134.14(D6) U$6.17(I/O5)
N$506: IC134.13(D5) U$6.16(I/O4)
N$507: IC134.8(D4) U$6.15(I/O3)
N$508: IC134.7(D3) U$6.13(I/O2)
N$509: IC134.4(D2) U$6.12(I/O1)
N$510: IC134.3(D1) U$6.11(I/O0)
N$511: IC135.3(D1) U$7.11(I/O0)
N$512: IC135.4(D2) U$7.12(I/O1)
N$513: IC135.7(D3) U$7.13(I/O2)
N$514: IC135.8(D4) U$7.15(I/O3)
N$515: IC135.13(D5) U$7.16(I/O4)
N$516: IC135.14(D6) U$7.17(I/O5)
N$517: IC135.17(D7) U$7.18(I/O6)
N$518: IC135.18(D8) U$7.19(I/O7)
N$519: IC136.3(D1) U$8.11(I/O0)
N$520: IC136.4(D2) U$8.12(I/O1)
N$521: IC136.7(D3) U$8.13(I/O2)
N$522: IC136.8(D4) U$8.15(I/O3)
N$523: IC136.13(D5) U$8.16(I/O4)
N$524: IC136.14(D6) U$8.17(I/O5)
N$525: IC136.17(D7) U$8.18(I/O6)
N$526: IC136.18(D8) U$8.19(I/O7)
N$527: IC137.3(D1) U$9.11(I/O0)
N$528: IC87.3(A:S2) R1.1 S1.1(O)
N$529: IC87.1(A:R) R2.1 S1.3(S)
N$531: IC87.4(A:Q) SW3.1
N$532: SW3.4
N$533: IC137.4(D2) U$9.12(I/O1)
N$534: IC137.7(D3) U$9.13(I/O2)
N$535: IC137.8(D4) U$9.15(I/O3)
N$536: IC137.13(D5) U$9.16(I/O4)
N$537: IC137.14(D6) U$9.17(I/O5)
N$538: IC137.17(D7) U$9.18(I/O6)
N$539: IC137.18(D8) U$9.19(I/O7)
N$541: IC64.1(A:I0) IC152.8(C:O)
N$542: IC165.19(8Q) IC215.9(A8)
N$543: IC246.2(1Q) IC259.2(A1)
N$544: IC246.5(2Q) IC259.3(A2)
N$545: IC246.6(3Q) IC259.4(A3)
N$546: IC246.9(4Q) IC259.5(A4)
N$547: IC246.12(5Q) IC259.6(A5)
N$548: IC57.3(B:I) IC139.3(Q1)
N$549: IC246.15(6Q) IC259.7(A6)
N$550: IC246.16(7Q) IC259.8(A7)
N$551: IC246.19(8Q) IC259.9(A8)
N$552: IC217.2(1Q) IC260.2(A1)
N$553: IC217.5(2Q) IC260.3(A2)
N$554: IC217.6(3Q) IC260.4(A3)
N$555: IC217.9(4Q) IC260.5(A4)
N$556: IC217.12(5Q) IC260.6(A5)
N$557: IC217.15(6Q) IC260.7(A6)
N$558: IC217.16(7Q) IC260.8(A7)
N$559: IC217.19(8Q) IC260.9(A8)
N$560: IC262.2(1Q) IC263.2(A1)
N$561: IC262.5(2Q) IC263.3(A2)
N$562: IC262.6(3Q) IC263.4(A3)
N$563: IC262.9(4Q) IC263.5(A4)
N$564: IC77.6(Q3)
N$565: IC262.12(5Q) IC263.6(A5)
N$566: IC262.15(6Q) IC263.7(A6)
N$567: IC70.13(D6) IC81.6(B:O)
N$568: IC77.9(Q4)
N$569: IC18.6(B:O) IC70.12(D7)
N$570: IC262.16(7Q) IC263.8(A7)
N$571: IC77.12(Q5)
N$572: IC262.19(8Q) IC263.9(A8)
N$573: IC261.2(1Q) IC264.2(A1)
N$574: IC16.2(1Q) IC211.2(A:A1)
N$575: IC16.5(2Q) IC211.4(A:A2)
N$576: IC16.6(3Q) IC211.6(A:A3)
N$577: IC4.6(3Q) IC111.15(B:A3)
N$578: IC4.9(4Q) IC111.17(B:A4)
N$579: IC4.12(5Q) IC112.11(B:A1)
N$580: IC4.15(6Q) IC112.13(B:A2)
N$581: IC4.16(7Q) IC112.15(B:A3)
N$582: IC4.19(8Q) IC112.17(B:A4)
N$583: IC98.2(1Q) IC113.2(A1)
N$584: IC98.5(2Q) IC113.3(A2)
N$585: IC98.6(3Q) IC113.4(A3)
N$586: IC98.9(4Q) IC113.5(A4)
N$587: IC98.12(5Q) IC113.6(A5)
N$588: IC98.15(6Q) IC113.7(A6)
N$589: IC98.16(7Q) IC113.8(A7)
N$590: IC98.19(8Q) IC113.9(A8)
N$591: IC99.2(1Q) IC114.2(A1)
N$592: IC99.5(2Q) IC114.3(A2)
N$593: IC99.6(3Q) IC114.4(A3)
N$594: IC99.9(4Q) IC114.5(A4)
N$595: IC99.12(5Q) IC114.6(A5)
N$596: IC99.15(6Q) IC114.7(A6)
N$597: IC99.16(7Q) IC114.8(A7)
N$598: IC261.5(2Q) IC264.3(A2)
N$599: IC261.6(3Q) IC264.4(A3)
N$600: IC261.9(4Q) IC264.5(A4)
N$601: IC16.9(4Q) IC211.8(A:A4)
N$602: IC77.15(Q6)
N$603: IC16.12(5Q) IC212.2(A:A1)
N$604: IC16.15(6Q) IC212.4(A:A2)
N$605: IC77.16(Q7)
N$606: IC77.19(Q8)
N$607: IC261.12(5Q) IC264.6(A5)
N$608: IC261.15(6Q) IC264.7(A6)
N$609: IC261.16(7Q) IC264.8(A7)
N$610: IC261.19(8Q) IC264.9(A8)
N$655: IC16.16(7Q) IC212.6(A:A3)
N$656: IC16.19(8Q) IC212.8(A:A4)
N$657: IC17.2(1Q) IC213.2(A:A1)
N$658: IC17.5(2Q) IC213.4(A:A2)
N$659: IC17.6(3Q) IC213.6(A:A3)
N$660: IC17.9(4Q) IC213.8(A:A4)
N$661: IC17.12(5Q) IC214.2(A:A1)
N$662: IC17.15(6Q) IC214.4(A:A2)
N$663: IC17.16(7Q) IC214.6(A:A3)
N$664: IC17.19(8Q) IC214.8(A:A4)
N$685: IC220.1(A:I0) IC222.12(Y3)
N$687: IC222.10(Y5) IC224.1(A:I0)
N$688: IC229.2(A:A1) IC234.2(1Q)
N$689: IC229.4(A:A2) IC234.5(2Q)
N$690: IC229.6(A:A3) IC234.6(3Q)
N$691: IC230.2(A:A1) IC234.12(5Q)
N$692: IC230.4(A:A2) IC234.15(6Q)
N$693: IC230.6(A:A3) IC234.16(7Q)
N$694: IC230.8(A:A4) IC234.19(8Q)
N$695: IC231.2(A:A1) IC233.2(1Q)
N$696: IC231.4(A:A2) IC233.5(2Q)
N$697: IC231.6(A:A3) IC233.6(3Q)
N$698: IC231.8(A:A4) IC233.9(4Q)
N$699: IC232.2(A:A1) IC233.12(5Q)
N$700: IC232.4(A:A2) IC233.15(6Q)
N$701: IC232.6(A:A3) IC233.16(7Q)
N$702: IC232.8(A:A4) IC233.19(8Q)
N$703: IC230.1(A:G)
N$704: IC234.9(4Q)
N$705: IC235.2(A:A1) IC240.2(1Q)
N$706: IC235.4(A:A2) IC240.5(2Q)
N$707: IC235.6(A:A3) IC240.6(3Q)
N$708: IC236.2(A:A1) IC240.12(5Q)
N$709: IC236.4(A:A2) IC240.15(6Q)
N$710: IC236.6(A:A3) IC240.16(7Q)
N$711: IC236.8(A:A4) IC240.19(8Q)
N$712: IC237.2(A:A1) IC239.2(1Q)
N$713: IC237.4(A:A2) IC239.5(2Q)
N$714: IC237.6(A:A3) IC239.6(3Q)
N$715: IC237.8(A:A4) IC239.9(4Q)
N$716: IC238.2(A:A1) IC239.12(5Q)
N$717: IC238.4(A:A2) IC239.15(6Q)
N$718: IC238.6(A:A3) IC239.16(7Q)
N$719: IC238.8(A:A4) IC239.19(8Q)
N$720: IC236.1(A:G)
N$721: IC240.9(4Q)
NOT_CONDITION: IC74.4(B:I0)
NOT_RST: IC75.1(CLR) IC76.1(CLR) IC77.1(CLR) IC78.1(CLR) IC79.1(CLR) IC134.1(CLR) IC135.1(CLR) IC136.1(CLR) IC137.1(CLR)
OF: IC122.5(A4) IC156.10(2C0) IC227.9(Q4) IC256.6(1C0)
OF_FROM_ALU: IC126.8(4D) IC156.12(2C2) IC256.5(1C1)
OF_IN_SRC_0: IC256.14(A)
OF_IN_SRC_1: IC256.2(B)
PANEL_MEM_IO: RN4.3
PANEL_RD: RN4.1
PANEL_WR: RN4.2
PCH_0: IC6.2(1Q) IC107.11(B:A1)
PCH_1: IC6.5(2Q) IC107.13(B:A2)
PCH_2: IC6.6(3Q) IC107.15(B:A3)
PCH_3: IC6.9(4Q) IC107.17(B:A4)
PCH_4: IC6.12(5Q) IC108.11(B:A1)
PCH_5: IC6.15(6Q) IC108.13(B:A2)
PCH_6: IC6.16(7Q) IC108.15(B:A3)
PCH_7: IC6.19(8Q) IC108.17(B:A4)
PCH_OUT: IC107.19(B:G) IC108.19(B:G)
PCH_WRT: IC6.1(G)
PCL_0: IC48.2(1Q) IC105.11(B:A1)
PCL_1: IC48.5(2Q) IC105.13(B:A2)
PCL_2: IC48.6(3Q) IC105.15(B:A3)
PCL_3: IC48.9(4Q) IC105.17(B:A4)
PCL_4: IC48.12(5Q) IC106.11(B:A1)
PCL_5: IC48.15(6Q) IC106.13(B:A2)
PCL_6: IC48.16(7Q) IC106.15(B:A3)
PCL_7: IC48.19(8Q) IC106.17(B:A4)
PCL_OUT: IC105.19(B:G) IC106.19(B:G)
PCL_WRT: IC48.1(G)
PF: IC70.15(D4) IC122.9(A8) IC208.6(1C0) IC227.12(Q5)
PF_FROM_ALU: IC59.2(A:O) IC208.5(1C1)
PF_IN_SRC_0: IC208.14(A)
PF_IN_SRC_1: IC208.2(B)
PROG_MODE: IC250.5(B:I1)
RD: IC69.9(B:Y1) RN4.16
REQ_ENCOD_0: IC222.1(A)
REQ_ENCOD_1: IC154.6(A5) IC222.2(B) IC226.7(A1)
REQ_ENCOD_2: IC154.5(A4) IC222.3(C) IC226.6(A2)
RST: IC54.3(B:I) IC128.15(CLR) IC139.15(CLR) IC144.15(CLR) IC248.15(CLR) IC249.15(CLR) R3.1 S2.2(P)
SF: IC122.4(A3) IC156.6(1C0) IC227.6(Q3) IC255.6(1C0)
SF_FROM_ALU: IC126.7(3D) IC156.4(1C2)
SF_IN_SRC_0: IC255.14(A)
SF_IN_SRC_1: IC255.2(B)
SF_XOR_OF: IC70.14(D5) IC72.6(B:O) IC81.4(B:I0)
SHR_MACHINE_H_OUT: IC104.1(G1) IC104.19(G2)
SHR_MACHINE_H_WRT: IC82.1(G)
SHR_MACHINE_IN_SRC: IC94.1(!A!/B) IC95.1(!A!/B) IC96.1(!A!/B) IC97.1(!A!/B)
SHR_MACHINE_L_OUT: IC103.1(G1) IC103.19(G2)
SHR_MACHINE_L_WRT: IC93.1(G)
SHR_MACHINE_TYPE: IC161.2(A:I1)
SPH_OUT: IC111.19(B:G) IC112.19(B:G)
SPH_WRT: IC4.1(G)
SPL_OUT: IC109.19(B:G) IC110.19(B:G)
SPL_WRT: IC5.1(G)
SS_H_OUT: IC260.1(G1) IC260.19(G2)
SS_H_WRT: IC217.1(G)
SS_L_OUT: IC259.1(G1) IC259.19(G2)
SS_L_WRT: IC246.1(G)
STOP_CLK: IC44.2(A:D) IC44.5(A:Q) IC147.4(B:I0) R9.1 S4.2(P)
TDR0_H_WRT: IC239.1(G)
TDR0_H_X_OUT: IC237.1(A:G) IC238.1(A:G)
TDR0_L_WRT: IC240.1(G)
TDR0_L_X_OUT: IC235.8(A:A4)
TDR0H_WRT: IC17.1(G)
TDR0H_Y_OUT: IC213.1(A:G) IC214.1(A:G)
TDR0L_OUT3: IC229.1(A:G)
TDR0L_OUT4: IC235.1(A:G)
TDR0L_WRT: IC16.1(G)
TDR0L_Y_OUT: IC211.1(A:G) IC212.1(A:G)
TDR1_H_WRT: IC233.1(G)
TDR1_H_X_OUT: IC231.1(A:G) IC232.1(A:G)
TDR1_L_WRT: IC234.1(G)
TDR1_L_X_OUT: IC229.8(A:A4)
TDR1H_WRT: IC88.1(G)
TDR1H_Y_OUT: IC91.1(A:G) IC92.1(A:G)
TDR1L_WRT: IC86.1(G)
TDR1L_Y_OUT: IC89.1(A:G) IC90.1(A:G)
TRAP: IC45.2(A:I1)
TRAP_REQ: IC8.3(A:CLK) IC148.1(A:I0) R5.2
TYP_0: IC43.3(B:I) IC67.4(B:I0) IC85.1(A:I0)
TYP_1: IC39.2(A:I1) IC42.1(A:I0) IC84.3(B:I)
U_AD0: IC32.2(Q1) U$6.10(A0) U$7.10(A0) U$8.10(A0) U$9.10(A0)
U_AD1: IC32.5(Q2) U$6.9(A1) U$7.9(A1) U$8.9(A1) U$9.9(A1)
U_AD2: IC32.6(Q3) U$6.8(A2) U$7.8(A2) U$8.8(A2) U$9.8(A2)
U_AD3: IC32.9(Q4) U$6.7(A3) U$7.7(A3) U$8.7(A3) U$9.7(A3)
U_AD4: IC32.12(Q5) U$6.6(A4) U$7.6(A4) U$8.6(A4) U$9.6(A4)
U_AD5: IC32.15(Q6) U$6.5(A5) U$7.5(A5) U$8.5(A5) U$9.5(A5)
U_AD6: IC32.16(Q7) U$6.4(A6) U$7.4(A6) U$8.4(A6) U$9.4(A6)
U_AD7: IC32.19(Q8) U$6.3(A7) U$7.3(A7) U$8.3(A7) U$9.3(A7)
U_AD8: IC33.2(Q1) U$6.25(A8) U$7.25(A8) U$8.25(A8) U$9.25(A8)
U_AD9: IC33.5(Q2) U$6.24(A9) U$7.24(A9) U$8.24(A9) U$9.24(A9)
U_AD10: IC33.6(Q3) U$6.21(A10) U$7.21(A10) U$8.21(A10) U$9.21(A10)
U_AD11: IC33.9(Q4) U$6.23(A11) U$7.23(A11) U$8.23(A11) U$9.23(A11)
U_AD12: IC33.12(Q5) U$6.2(A12) U$7.2(A12) U$8.2(A12) U$9.2(A12)
U_AD13: IC33.15(Q6) U$6.26(A13) U$7.26(A13) U$8.26(A13) U$9.26(A13)
U_AD14: IC33.16(Q7)
U_AD15: IC33.19(Q8)
U_AD_BUFF0: U$1.10(A0)
U_AD_BUFF1: U$1.9(A1)
U_AD_BUFF2: U$1.8(A2)
U_AD_BUFF3: U$1.7(A3)
U_AD_BUFF4: U$1.6(A4)
U_AD_BUFF5: U$1.5(A5)
U_AD_BUFF6: U$1.4(A6)
U_AD_BUFF7: U$1.3(A7)
U_AD_BUFF8: U$1.25(A8)
U_AD_BUFF9: U$1.24(A9)
U_AD_BUFF10: U$1.21(A10)
U_AD_BUFF11: U$1.23(A11)
U_AD_BUFF12: U$1.2(A12)
U_AD_BUFF13: U$1.26(A13)
U_ADDER_0: IC50.4(S1) IC186.4(D0)
U_ADDER_1: IC160.4(D0)
U_ADDER_2: IC159.4(D0)
U_ADDER_3: IC142.4(D0)
U_ADDER_4: IC129.4(D0)
U_ADDER_5: IC73.4(D0)
U_ADDER_6: IC34.4(D0)
U_ADDER_7: IC35.4(D0)
U_ADDER_8: IC36.4(D0)
U_ADDER_9: IC37.4(D0)
U_ADDER_10: IC38.4(D0)
U_ADDER_11: IC40.4(D0)
U_ADDER_12: IC41.4(D0)
U_ADDER_13: IC53.1(S2) IC71.4(D0)
U_ADDR_MUX_1: IC42.3(A:O)
U_CF: IC126.5(2Q) IC155.11(2C1) IC167.3(1B)
U_DMA_0: IC186.14(D5)
U_DMA_1: IC160.14(D5)
U_DMA_2: IC159.14(D5)
U_DMA_3: IC142.14(D5)
U_DMA_4: IC129.14(D5)
U_DMA_5: IC73.14(D5)
U_DMA_6: IC34.14(D5)
U_DMA_7: IC35.14(D5)
U_DMA_8: IC36.14(D5)
U_DMA_9: IC37.14(D5)
U_DMA_10: IC38.14(D5)
U_DMA_11: IC40.14(D5)
U_DMA_12: IC41.14(D5)
U_DMA_13: IC71.14(D5)
U_FETCH_0: IC186.2(D2)
U_FETCH_1: IC160.2(D2)
U_FETCH_2: IC159.2(D2)
U_FETCH_3: IC142.2(D2)
U_FETCH_4: IC129.2(D2)
U_FETCH_5: IC73.2(D2)
U_FETCH_6: IC34.2(D2)
U_FETCH_7: IC35.2(D2)
U_FETCH_8: IC36.2(D2)
U_FETCH_9: IC37.2(D2)
U_FETCH_10: IC38.2(D2)
U_FETCH_11: IC40.2(D2)
U_FETCH_12: IC41.2(D2)
U_FETCH_13: IC71.2(D2)
U_FLAGS_REG_WRT: IC126.1(G)
U_INTERRUPT_0: IC186.1(D3)
U_INTERRUPT_1: IC160.1(D3)
U_INTERRUPT_2: IC159.1(D3)
U_INTERRUPT_3: IC142.1(D3)
U_INTERRUPT_4: IC129.1(D3)
U_INTERRUPT_5: IC73.1(D3)
U_INTERRUPT_6: IC34.1(D3)
U_INTERRUPT_7: IC35.1(D3)
U_INTERRUPT_8: IC36.1(D3)
U_INTERRUPT_9: IC37.1(D3)
U_INTERRUPT_10: IC38.1(D3)
U_INTERRUPT_11: IC40.1(D3)
U_INTERRUPT_12: IC41.1(D3)
U_INTERRUPT_13: IC71.1(D3)
U_OF: IC126.9(4Q) IC156.11(2C1)
U_OFFSET0: IC49.3(1B)
U_OFFSET1: IC49.6(2B)
U_OFFSET2: IC49.10(3B)
U_OFFSET3: IC49.13(4B)
U_OFFSET4: IC55.3(1B)
U_OFFSET5: IC55.6(2B)
U_OFFSET6: IC55.10(3B)
U_SF: IC126.6(3Q) IC156.5(1C1)
U_TRAP_0: IC186.15(D4)
U_TRAP_1: IC160.15(D4)
U_TRAP_2: IC159.15(D4)
U_TRAP_3: IC142.15(D4)
U_TRAP_4: IC129.15(D4)
U_TRAP_5: IC73.15(D4)
U_TRAP_6: IC34.15(D4)
U_TRAP_7: IC35.15(D4)
U_TRAP_8: IC36.15(D4)
U_TRAP_9: IC37.15(D4)
U_TRAP_10: IC38.15(D4)
U_TRAP_11: IC40.15(D4)
U_TRAP_12: IC41.15(D4)
U_TRAP_13: IC71.15(D4)
U_ZF: IC47.1(A:I0) IC126.2(1Q) IC127.2(A:I1) IC155.5(1C1)
U_ZF_IN_SRC: IC121.1(!A!/B)
UZF_AND_ALUZF: IC47.2(A:I1) IC119.3(B:I)
VCC: IC8.2(A:D) IC8.4(A:PRE) IC44.1(A:CLR) IC49.2(1A) IC56.5(1C1) IC163.2(A:D) IC163.4(A:PRE) IC164.2(A:D) IC164.4(A:PRE) IC168.2(A:D) IC168.4(A:PRE) IC174.2(A:D) IC174.4(A:PRE) IC187.2(A:D) IC187.4(A:PRE) IC188.2(A:D) IC188.4(A:PRE) IC204.4(A:PRE) IC221.2(A:D) IC221.4(A:PRE) IC222.6(G1) R1.2 R2.2 R3.2 R9.2
WR: IC69.7(B:Y2) RN4.15
XBUS0: IC2.18(Y1) IC9.18(Y1) IC25.9(B:Y1) IC27.9(B:Y1) IC103.18(Y1) IC104.18(Y1) IC105.9(B:Y1) IC107.9(B:Y1) IC109.9(B:Y1) IC111.9(B:Y1) IC113.18(Y1) IC114.18(Y1) IC116.18(Y1) IC117.18(Y1) IC122.18(Y1) IC125.18(Y1) IC140.18(Y1) IC145.18(Y1) IC154.18(Y1) IC181.18(A:Y1) IC210.18(Y1) IC244.9(B:Y1) IC245.18(Y1) RN1.1
XBUS1: IC2.17(Y2) IC9.17(Y2) IC25.7(B:Y2) IC27.7(B:Y2) IC105.7(B:Y2) IC107.7(B:Y2) IC109.7(B:Y2) IC111.7(B:Y2) IC113.17(Y2) IC114.17(Y2) IC116.17(Y2) IC117.17(Y2) IC122.17(Y2) IC125.17(Y2) IC145.17(Y2) IC154.17(Y2) IC181.16(A:Y2) IC245.17(Y2) RN1.2
XBUS2: IC2.16(Y3) IC9.16(Y3) IC25.5(B:Y3) IC27.5(B:Y3) IC105.5(B:Y3) IC107.5(B:Y3) IC109.5(B:Y3) IC111.5(B:Y3) IC113.16(Y3) IC114.16(Y3) IC116.16(Y3) IC117.16(Y3) IC122.16(Y3) IC125.16(Y3) IC145.16(Y3) IC154.16(Y3) IC181.14(A:Y3) IC245.16(Y3) RN1.3
XBUS3: IC2.15(Y4) IC9.15(Y4) IC25.3(B:Y4) IC27.3(B:Y4) IC105.3(B:Y4) IC107.3(B:Y4) IC109.3(B:Y4) IC111.3(B:Y4) IC113.15(Y4) IC114.15(Y4) IC116.15(Y4) IC117.15(Y4) IC122.15(Y4) IC125.15(Y4) IC145.15(Y4) IC154.15(Y4) IC181.12(A:Y4) IC244.3(B:Y4) IC245.15(Y4) RN1.4
XBUS4: IC24.9(B:Y1) IC26.9(B:Y1) IC106.9(B:Y1) IC108.9(B:Y1) IC110.9(B:Y1) IC112.9(B:Y1) IC116.14(Y5) IC125.14(Y5) IC154.14(Y5) IC176.18(A:Y1) IC245.14(Y5) IC247.9(B:Y1) RN1.5
XBUS5: IC24.7(B:Y2) IC26.7(B:Y2) IC106.7(B:Y2) IC108.7(B:Y2) IC110.7(B:Y2) IC112.7(B:Y2) IC116.13(Y6) IC125.13(Y6) IC154.13(Y6) IC176.16(A:Y2) IC245.13(Y6) RN1.6
XBUS6: IC24.5(B:Y3) IC26.5(B:Y3) IC106.5(B:Y3) IC108.5(B:Y3) IC110.5(B:Y3) IC112.5(B:Y3) IC113.12(Y7) IC114.12(Y7) IC115.12(Y7) IC116.12(Y7) IC125.12(Y7) IC154.12(Y7) IC176.14(A:Y3) IC245.12(Y7) RN1.7
XBUS7: IC2.11(Y8) IC3.11(Y8) IC9.11(Y8) IC24.3(B:Y4) IC26.3(B:Y4) IC80.4(B:I0) IC102.11(Y8) IC103.11(Y8) IC104.11(Y8) IC106.3(B:Y4) IC108.3(B:Y4) IC110.3(B:Y4) IC112.3(B:Y4) IC113.11(Y8) IC114.11(Y8) IC115.11(Y8) IC116.11(Y8) IC117.11(Y8) IC122.11(Y8) IC125.11(Y8) IC130.5(B:I1) IC140.11(Y8) IC145.11(Y8) IC146.11(Y8) IC154.11(Y8) IC176.12(A:Y4) IC210.11(Y8) IC245.11(Y8) IC247.3(B:Y4) RN1.8
XBUS8: IC146.18(Y1)
XBUS9: IC146.17(Y2)
XBUS10: IC146.16(Y3)
XBUS11: IC146.15(Y4)
XBUS12: IC171.18(Y1) IC215.18(Y1)
XBUS13: IC171.11(Y8) IC215.11(Y8)
XBUS14: IC259.18(Y1) IC260.18(Y1)
XBUS15: IC259.11(Y8) IC260.11(Y8)
XBUS16: IC89.18(A:Y1) IC91.18(A:Y1)
XBUS17: IC89.16(A:Y2) IC91.16(A:Y2)
XBUS18: IC89.14(A:Y3) IC91.14(A:Y3)
XBUS19: IC89.12(A:Y4) IC91.12(A:Y4)
XBUS20: IC90.18(A:Y1) IC92.18(A:Y1)
XBUS21: IC90.16(A:Y2) IC92.16(A:Y2)
XBUS22: IC90.14(A:Y3) IC92.14(A:Y3)
XBUS23: IC90.12(A:Y4) IC92.12(A:Y4)
XBUS24: IC14.1(B0) RN2.1
XBUS25: IC14.22(B1) RN2.2
XBUS26: IC14.20(B2) RN2.3
XBUS27: IC14.18(B3) RN2.4
XBUS28: IC11.12(A:Y4) IC15.1(B0) RN2.5
XBUS29: IC11.14(A:Y3) IC15.22(B1) RN2.6
XBUS30: IC11.16(A:Y2) IC15.20(B2) RN2.7
XBUS31: IC11.18(A:Y1) IC15.18(B3) RN2.8
XBUS32: IC102.18(Y1)
XBUS33: IC102.17(Y2)
XBUS34: IC102.16(Y3)
XBUS35: IC102.15(Y4)
XBUS36: IC263.18(Y1) IC264.18(Y1)
XBUS37: IC263.11(Y8) IC264.11(Y8)
XBUS40: IC3.18(Y1)
XBUS41: IC3.17(Y2)
XBUS42: IC3.16(Y3)
XBUS43: IC3.15(Y4)
XBUS48: IC115.18(Y1)
XBUS49: IC115.17(Y2)
XBUS50: IC115.16(Y3)
XBUS51: IC115.15(Y4)
XBUS56: IC15.19(A3) RN3.1
XBUS57: IC15.21(A2) RN3.2
XBUS58: IC15.23(A1) RN3.3
XBUS59: IC15.2(A0) RN3.4
XBUS60: IC14.19(A3) RN3.5
XBUS61: IC14.21(A2) RN3.6
XBUS62: IC14.23(A1) RN3.7
XBUS63: IC14.2(A0) RN3.8
YBUS0: IC19.18(Y1) IC182.18(A:Y1)
YBUS1: IC19.17(Y2) IC182.16(A:Y2)
YBUS2: IC19.16(Y3) IC182.14(A:Y3)
YBUS3: IC19.15(Y4) IC182.12(A:Y4)
YBUS4: IC19.14(Y5) IC183.18(A:Y1)
YBUS5: IC183.16(A:Y2)
YBUS6: IC183.14(A:Y3)
YBUS7: IC19.11(Y8) IC130.4(B:I0) IC183.12(A:Y4)
YBUS16: IC211.18(A:Y1) IC213.18(A:Y1)
YBUS17: IC211.16(A:Y2) IC213.16(A:Y2)
YBUS18: IC211.14(A:Y3) IC213.14(A:Y3)
YBUS19: IC211.12(A:Y4) IC213.12(A:Y4)
YBUS20: IC212.18(A:Y1) IC214.18(A:Y1)
YBUS21: IC212.16(A:Y2) IC214.16(A:Y2)
YBUS22: IC212.14(A:Y3) IC214.14(A:Y3)
YBUS23: IC212.12(A:Y4) IC214.12(A:Y4)
YBUS40: IC229.18(A:Y1) IC231.18(A:Y1)
YBUS41: IC229.16(A:Y2) IC231.16(A:Y2)
YBUS42: IC229.14(A:Y3) IC231.14(A:Y3)
YBUS43: IC229.12(A:Y4) IC231.12(A:Y4)
YBUS44: IC230.18(A:Y1) IC232.18(A:Y1)
YBUS45: IC230.16(A:Y2) IC232.16(A:Y2)
YBUS46: IC230.14(A:Y3) IC232.14(A:Y3)
YBUS47: IC230.12(A:Y4) IC232.12(A:Y4)
YBUS48: IC235.18(A:Y1) IC237.18(A:Y1)
YBUS49: IC235.16(A:Y2) IC237.16(A:Y2)
YBUS50: IC235.14(A:Y3) IC237.14(A:Y3)
YBUS51: IC235.12(A:Y4) IC237.12(A:Y4)
YBUS52: IC236.18(A:Y1) IC238.18(A:Y1)
YBUS53: IC236.16(A:Y2) IC238.16(A:Y2)
YBUS54: IC236.14(A:Y3) IC238.14(A:Y3)
YBUS55: IC236.12(A:Y4) IC238.12(A:Y4)
ZBUFF0_16: IC86.3(1D) IC88.3(1D)
ZBUFF0_17: IC86.4(2D) IC88.4(2D)
ZBUFF0_18: IC86.7(3D) IC88.7(3D)
ZBUFF0_19: IC86.8(4D) IC88.8(4D)
ZBUFF0_20: IC86.13(5D) IC88.13(5D)
ZBUFF0_21: IC88.14(6D)
ZBUFF0_22: IC86.14(6D) IC86.17(7D) IC88.17(7D)
ZBUFF0_23: IC86.18(8D) IC88.18(8D)
ZBUFF0_24: IC16.3(1D) IC17.3(1D)
ZBUFF0_25: IC16.4(2D) IC17.4(2D)
ZBUFF0_26: IC16.7(3D) IC17.7(3D)
ZBUFF0_27: IC16.8(4D) IC17.8(4D)
ZBUFF0_28: IC16.13(5D) IC17.13(5D)
ZBUFF0_29: IC16.14(6D) IC17.14(6D)
ZBUFF0_30: IC16.17(7D) IC17.17(7D)
ZBUFF0_31: IC16.18(8D) IC17.18(8D)
ZBUFF0_56: IC233.3(1D) IC234.3(1D)
ZBUFF0_57: IC233.4(2D) IC234.4(2D)
ZBUFF0_58: IC233.7(3D) IC234.7(3D)
ZBUFF0_59: IC233.8(4D) IC234.8(4D)
ZBUFF0_60: IC233.13(5D) IC234.13(5D)
ZBUFF0_61: IC233.14(6D) IC234.14(6D)
ZBUFF0_62: IC233.17(7D) IC234.17(7D)
ZBUFF0_63: IC233.18(8D) IC234.18(8D)
ZBUFF0_64: IC239.3(1D) IC240.3(1D)
ZBUFF0_65: IC239.4(2D) IC240.4(2D)
ZBUFF0_66: IC239.7(3D) IC240.7(3D)
ZBUFF0_67: IC239.8(4D) IC240.8(4D)
ZBUFF0_68: IC239.13(5D) IC240.13(5D)
ZBUFF0_69: IC239.14(6D) IC240.14(6D)
ZBUFF0_70: IC239.17(7D) IC240.17(7D)
ZBUFF0_71: IC239.18(8D) IC240.18(8D)
ZBUFF1_0: IC4.3(1D) IC5.3(1D) IC98.3(1D) IC99.3(1D)
ZBUFF1_1: IC4.4(2D) IC5.4(2D) IC98.4(2D) IC99.4(2D)
ZBUFF1_2: IC4.7(3D) IC5.7(3D) IC98.7(3D) IC99.7(3D)
ZBUFF1_3: IC4.8(4D) IC5.8(4D) IC98.8(4D) IC99.8(4D)
ZBUFF1_4: IC4.13(5D) IC5.13(5D) IC98.13(5D) IC99.13(5D)
ZBUFF1_5: IC4.14(6D) IC5.14(6D) IC98.14(6D) IC99.14(6D)
ZBUFF1_6: IC4.17(7D) IC5.17(7D) IC98.17(7D) IC99.17(7D)
ZBUFF1_7: IC4.18(8D) IC5.18(8D) IC98.18(8D) IC99.18(8D)
ZBUFF1_8: IC173.3(1D) IC205.3(1D)
ZBUFF1_9: IC173.4(2D) IC205.4(2D)
ZBUFF1_10: IC173.7(3D) IC205.7(3D)
ZBUFF1_11: IC173.8(4D) IC205.8(4D)
ZBUFF1_12: IC173.13(5D) IC205.13(5D)
ZBUFF1_13: IC173.14(6D) IC205.14(6D)
ZBUFF1_14: IC173.17(7D) IC205.17(7D)
ZBUFF1_15: IC173.18(8D) IC205.18(8D)
ZBUFF1_16: IC165.3(1D) IC166.3(1D)
ZBUFF1_17: IC165.4(2D) IC166.4(2D)
ZBUFF1_18: IC165.7(3D) IC166.7(3D)
ZBUFF1_19: IC165.8(4D) IC166.8(4D)
ZBUFF1_20: IC165.13(5D) IC166.13(5D)
ZBUFF1_21: IC165.14(6D) IC166.14(6D)
ZBUFF1_22: IC165.17(7D) IC166.17(7D)
ZBUFF1_23: IC165.18(8D) IC166.18(8D)
ZBUFF1_24: IC217.3(1D) IC246.3(1D)
ZBUFF1_25: IC217.4(2D) IC246.4(2D)
ZBUFF1_26: IC217.7(3D) IC246.7(3D)
ZBUFF1_27: IC217.8(4D) IC246.8(4D)
ZBUFF1_28: IC217.13(5D) IC246.13(5D)
ZBUFF1_29: IC217.14(6D) IC246.14(6D)
ZBUFF1_30: IC217.17(7D) IC246.17(7D)
ZBUFF1_31: IC217.18(8D) IC246.18(8D)
ZBUFF1_32: IC261.3(1D) IC262.3(1D)
ZBUFF1_33: IC261.4(2D) IC262.4(2D)
ZBUFF1_34: IC261.7(3D) IC262.7(3D)
ZBUFF1_35: IC261.8(4D) IC262.8(4D)
ZBUFF1_36: IC261.13(5D) IC262.13(5D)
ZBUFF1_37: IC261.14(6D) IC262.14(6D)
ZBUFF1_38: IC261.17(7D) IC262.17(7D)
ZBUFF1_39: IC261.18(8D) IC262.18(8D)
ZBUFF2_0: IC1.3(1D) IC23.14(4A) IC100.3(1D) IC101.3(1D)
ZBUFF2_1: IC1.4(2D) IC23.11(3A) IC100.4(2D) IC101.4(2D)
ZBUFF2_2: IC1.7(3D) IC23.5(2A) IC100.7(3D) IC101.7(3D)
ZBUFF2_3: IC1.8(4D) IC23.2(1A) IC100.8(4D) IC101.8(4D)
ZBUFF2_4: IC1.13(5D) IC22.14(4A) IC100.13(5D) IC101.13(5D)
ZBUFF2_5: IC1.14(6D) IC22.11(3A) IC100.14(6D) IC101.14(6D)
ZBUFF2_6: IC1.17(7D) IC22.5(2A) IC100.17(7D) IC101.17(7D)
ZBUFF2_7: IC22.2(1A) IC100.18(8D) IC101.18(8D)
ZBUFF2_16: IC123.3(1D)
ZBUFF2_17: IC123.4(2D)
ZBUFF2_18: IC123.7(3D)
ZBUFF2_19: IC123.8(4D)
ZBUFF2_20: IC123.13(5D)
ZBUFF2_21: IC123.14(6D)
ZBUFF2_22: IC123.17(7D)
ZBUFF2_23: IC153.3(1D)
ZBUFF2_24: IC153.4(2D)
ZBUFF2_25: IC153.7(3D)
ZBUFF2_26: IC153.8(4D)
ZBUFF2_27: IC153.13(5D)
ZBUFF2_28: IC153.14(6D)
ZBUFF2_29: IC153.17(7D)
ZBUFF2_30: IC153.18(8D)
ZBUFF2_31: IC185.3(1D)
ZBUFF2_32: IC185.4(2D)
ZBUFF2_33: IC185.7(3D)
ZBUFF2_34: IC185.8(4D)
ZBUFF2_35: IC185.13(5D)
ZBUFF2_36: IC185.14(6D)
ZBUFF2_37: IC185.17(7D)
ZBUFF2_38: IC185.18(8D)